# Altium project OpenRex_V1I1.PrjPcb (part 12 of 13)

## Sheet [21] - AUDIO.SchDoc
size A3; DocumentNumber: 21; SheetNumber: 21; SheetTotal: 31
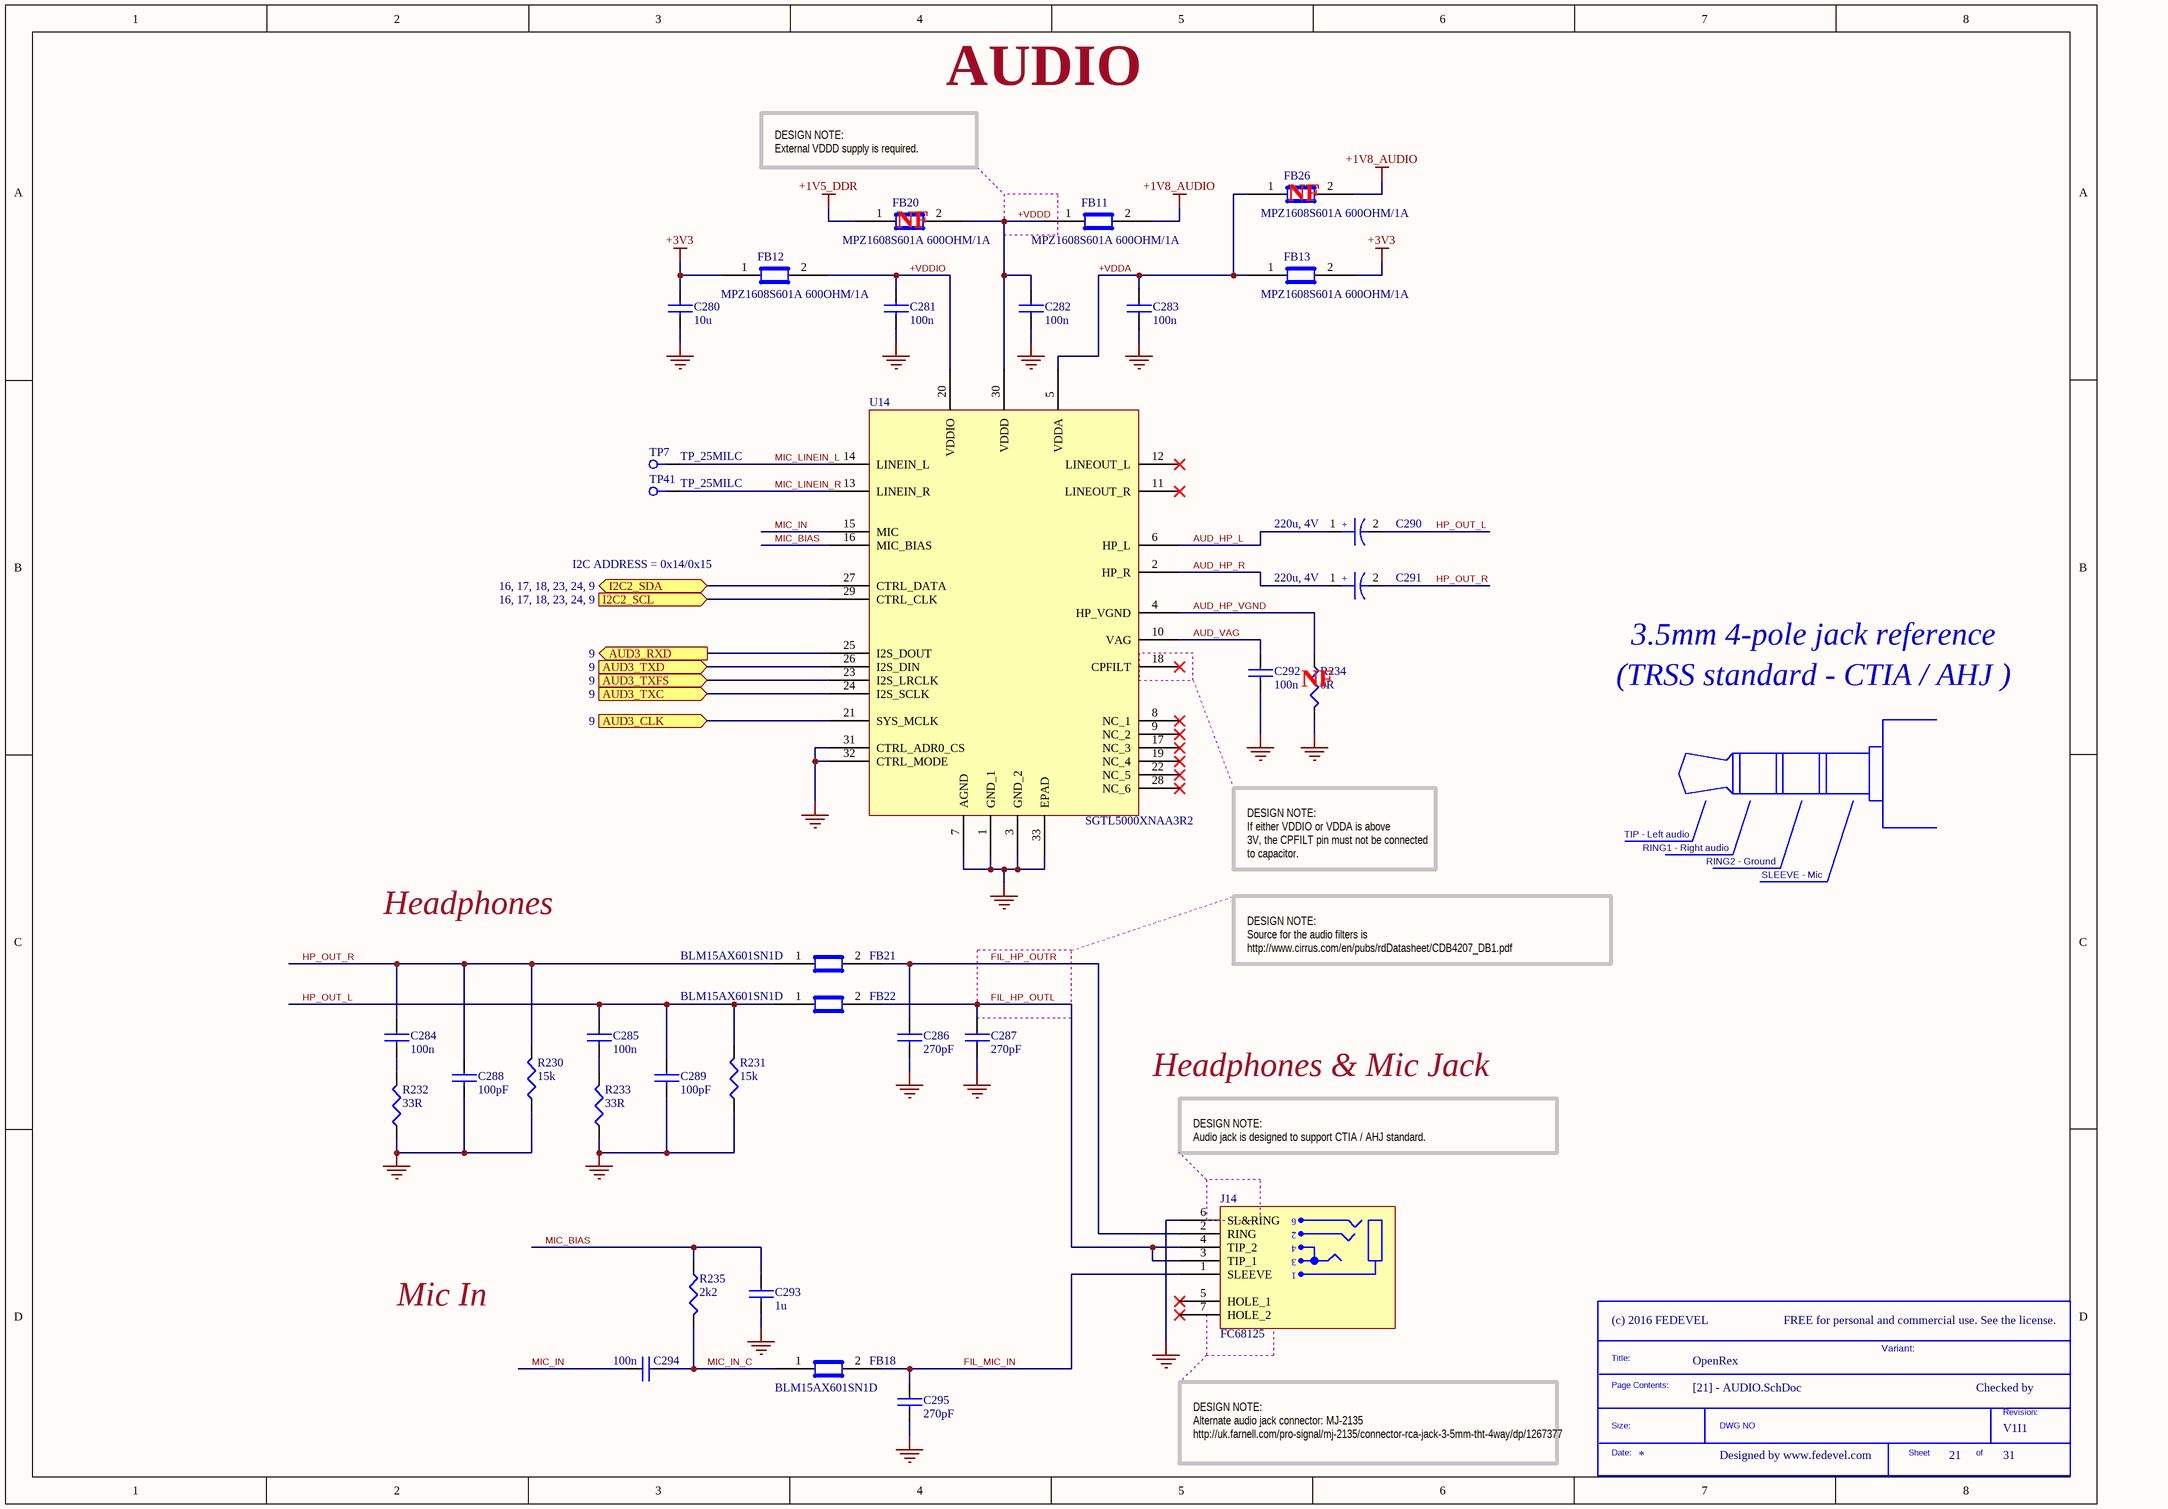
[diagram p46: [21] - AUDIO.SchDoc]

### Parts
(Parts that share a designator on the sheet are numbered #1, #2 ... from top to bottom, then left to right.)
*#28  SDTitleBlock  (value not drawn)  (graphical)
C280  10u  [C0603]
C281  100n  [C0402]
C282  100n  [C0402]
C283  100n  [C0402]
C284  100n  [C0402]
C285  100n  [C0402]
C286  270pF  [C0402]
C287  270pF  [C0402]
C288  100pF  [C0402]
C289  100pF  [C0402]
C290  220u, 4V  [C1206 -  TLN S Case Tantal]
C291  220u, 4V  [C1206 -  TLN S Case Tantal]
C292  100n  [C0402]
C293  1u  [C0402]
C294  100n  [C0402]
C295  270pF  [C0402]
FB11  MPZ1608S601A 600OHM/1A  [C0603]
FB12  MPZ1608S601A 600OHM/1A  [C0603]
FB13  MPZ1608S601A 600OHM/1A  [C0603]
FB18  BLM15AX601SN1D  [C0402]
FB20  MPZ1608S601A 600OHM/1A  [C0603]
FB21  BLM15AX601SN1D  [C0402]
FB22  BLM15AX601SN1D  [C0402]
FB26  MPZ1608S601A 600OHM/1A  [C0603]
J14  FC68125  [FC68125]
R230  15k  [R0402]
R231  15k  [R0402]
R232  33R  [R0402]
R233  33R  [R0402]
R234  0R  [R0402]
R235  2k2  [R0402]
TP7  TP_25MILC  [TP_25C]  (no BOM)
TP41  TP_25MILC  [TP_25C]  (no BOM)
U14  SGTL5000XNAA3R2  [QFN32 5x5x0.85_V1.1]

### Ports
AUD3_CLK (in, see 9), AUD3_RXD (out, see 9), AUD3_TXC (in, see 9), AUD3_TXD (in, see 9), AUD3_TXFS (in, see 9), I2C2_SCL (see 16, 17, 18, 23, 24, 9), I2C2_SDA (bidir, see 16, 17, 18, 23, 24, 9)

### Nets
+1V5_DDR: FB20.1
+1V8_AUDIO: FB11.2 FB26.2
+3V3: C280.1 FB12.1 FB13.2
GND: C280.2 C281.2 C282.2 C283.2 C286.2 C287.2 C288.2 C289.2 C292.2 C293.2 C295.2 J14.6(SL&RING) R230.1 R231.1 R232.1 R233.1 R234.2 U14.1(GND_1) U14.3(GND_2) U14.7(AGND) U14.31(CTRL_ADR0_CS) U14.32(CTRL_MODE) U14.33(EPAD)
+VDDA: C283.1 FB13.1 FB26.1 U14.5(VDDA)
+VDDD: C282.1 FB11.1 FB20.2 U14.30(VDDD)
+VDDIO: C281.1 FB12.2 U14.20(VDDIO)
AUD3_CLK: U14.21(SYS_MCLK) ; port AUD3_CLK
AUD3_RXD: U14.25(I2S_DOUT) ; port AUD3_RXD
AUD3_TXC: U14.24(I2S_SCLK) ; port AUD3_TXC
AUD3_TXD: U14.26(I2S_DIN) ; port AUD3_TXD
AUD3_TXFS: U14.23(I2S_LRCLK) ; port AUD3_TXFS
AUD_HP_L: C290.1 U14.6(HP_L)
AUD_HP_R: C291.1 U14.2(HP_R)
AUD_HP_VGND: R234.1 U14.4(HP_VGND)
AUD_VAG: C292.1 U14.10(VAG)
FIL_HP_OUTL: C287.1 FB22.2 J14.3(TIP_1) J14.4(TIP_2)
FIL_HP_OUTR: C286.1 FB21.2 J14.2(RING)
FIL_MIC_IN: C295.1 FB18.2 J14.1(SLEEVE)
HP_OUT_L: C285.1 C289.1 C290.2 FB22.1 R231.2
HP_OUT_R: C284.1 C288.1 C291.2 FB21.1 R230.2
I2C2_SCL: U14.29(CTRL_CLK) ; port I2C2_SCL
I2C2_SDA: U14.27(CTRL_DATA) ; port I2C2_SDA
MIC_BIAS: C293.1 R235.1 U14.16(MIC_BIAS)
MIC_IN: C294.1 U14.15(MIC)
MIC_IN_C: C294.2 FB18.1 R235.2
MIC_LINEIN_L: TP7.1 U14.14(LINEIN_L)
MIC_LINEIN_R: TP41.1 U14.13(LINEIN_R)
NetC284_2: C284.2 R232.2
NetC285_2: C285.2 R233.2

Not connected (* = marked no-connect by the designer): J14 5(HOLE_1)* 7(HOLE_2)*; U14 8(NC_1)* 9(NC_2)* 11(LINEOUT_R)* 12(LINEOUT_L)* 17(NC_3)* 18(CPFILT)* 19(NC_4)* 22(NC_5)* 28(NC_6)*

### Notes on the sheet
- AUDIO
- DESIGN NOTE:
  External VDDD supply is required.
- I2C ADDRESS = 0x14/0x15
- 3.5mm 4-pole jack reference
- (TRSS standard - CTIA / AHJ )
- TIP - Left audio
- RING1 - Right audio
- RING2 - Ground
- Headphones
- DESIGN NOTE:
  If either VDDIO or VDDA is above
  3V, the CPFILT pin must not be connected to capacitor.
- SLEEVE - Mic
- DESIGN NOTE:
  Source for the audio filters is http://www.cirrus.com/en/pubs/rdDatasheet/CDB4207_DB1.pdf
- Headphones & Mic Jack
- DESIGN NOTE:
  Audio jack is designed to support CTIA / AHJ standard.
- Mic In
- FREE for personal and commercial use. See the license.
- Variant:
- Checked by
- DESIGN NOTE:
  Alternate audio jack connector: MJ-2135
  http://uk.farnell.com/pro-signal/mj-2135/connector-rca-jack-3-5mm-tht-4way/dp/1267377
- Designed by www.fedevel.com
- (in symbol SDTitleBlock) Title:; Page Contents:; Revision:; Size:; DWG NO; Date:; Sheet; of
- (in symbol TLNS227M004R3000) +

### Library data of the parts
C280 = C1608X5R0J106M: CAP CER 10UF 6.3V X5R 20% 0603; Manufacturer: TDK Corporation; Capacitance: 10µF; Value: 10µF; .Checked PCB: used; Category: Capacitors; Supplier Part Number: 445-4112-1-ND; Manufacturer Part Number: C1608X5R0J106M; Operating Temperature: -55°C ~ 85°C; Package / Case: 0603 (1608 Metric); Price 1k [$]: 0.08580; .Checked SCH: used; Voltage - Rated: 6.3V; Features: Low ESR; Supplier: Digikey; Supplier 1: Digi-Key; Supplier Part Number 1: 445-4112-1-ND; RoHS: RoHS Compliant; Stock 1: 48157; Pricing 1: 1=0.46, 10=0.363, 100=0.1898, 250=0.14024, 500=0.1089, 1000=0.0858 (USD); Tolerance: ±20%; Temperature Coefficient: X5R; Mounting Type: Surface Mount, MLCC; Applications: General Purpose; Ratings: -; Size / Dimension: 0.063" L x 0.031" W (1.60mm x 0.80mm); Height - Seated (Max): -; Thickness (Max): 0.037" (0.95mm); Lead Spacing: -; Packaging: Cut Tape (CT); Lead Style: -; ComponentLink1URL: http://www.tdk.com/pdf/general_B11.pdf; ComponentLink1Description: http://www.tdk.com/pdf/general_B11.pdf
C281-C285 C292 C294 = C1005X5R1H104K: as C309 on sheet [23] - SENSORS, CAN, IR; Category: Capacitors; Supplier Part Number: 445-5942-1-ND; Manufacturer Part Number: C1005X5R1H104K; Operating Temperature: -55°C ~ 85°C; Package / Case: 0402 (1005 Metric); Price 1k [$]: 0.02340; .Checked SCH: used; Voltage - Rated: 50V; Supplier: Digikey; Supplier 1: Digi-Key; Supplier Part Number 1: 445-5942-1-ND; RoHS: RoHS Compliant; Stock 1: 106926; Pricing 1: 1=0.27, 10=0.18, 100=0.072, 250=0.05176, 500=0.0369, 1000=0.027 (USD); Tolerance: ±10%; Temperature Coefficient: X5R; Mounting Type: Surface Mount, MLCC; Applications: General Purpose; Ratings: -; Size / Dimension: 0.039" L x 0.020" W (1.00mm x 0.50mm); Height - Seated (Max): -; Thickness (Max): 0.022" (0.55mm); Lead Spacing: -; Features: -; Packaging: Cut Tape (CT); Lead Style: -; ComponentLink1URL: http://www.tdk.co.jp/tefe02/e412_c.pdf; ComponentLink1Description: http://www.tdk.co.jp/tefe02/e412_c.pdf
C286 C287 C295 = GRM155R71H271KA01D: CAP CER 270PF 50V 10% X7R 0402; Manufacturer: Murata Electronics North America; .Checked PCB: used; Supplier 1: Digi-Key; Supplier Part Number 1: 490-1299-1-ND; Manufacturer Part Number: GRM155R71H271KA01D; RoHS: RoHS Compliant; Category: Capacitors; Stock 1: 83894; Pricing 1: 10=0.032, 50=0.0252, 100=0.0189, 250=0.01364, 500=0.01008, 1000=0.00683, 5000=0.00525 (USD); Capacitance: 270pF; Voltage - Rated: 50V; Tolerance: ±10%; Temperature Coefficient: X7R; Mounting Type: Surface Mount, MLCC; Operating Temperature: -55°C ~ 125°C; Applications: General Purpose; Ratings: -; Package / Case: 0402 (1005 Metric); Size / Dimension: 0.039" L x 0.020" W (1.00mm x 0.50mm); Height - Seated (Max): -; Thickness (Max): 0.022" (0.55mm); Lead Spacing: -; Features: -; Packaging: Cut Tape (CT); Lead Style: -; ComponentLink1URL: http://search.murata.co.jp/Ceramy/image/img/PDF/ENG/GRM155R71H271KA01.pdf; ComponentLink1Description: http://search.murata.co.jp/Ceramy/image/img/PDF/ENG/GRM155R71H271KA01.pdf; .Checked SCH: used
C288 C289 = C1005C0G1H101J: as C311 on sheet [23] - SENSORS, CAN, IR; Supplier 1: Digi-Key; Supplier Part Number 1: 445-1247-1-ND; Manufacturer Part Number: C1005C0G1H101J; RoHS: RoHS Compliant; Category: Capacitors; Stock 1: 298233; Pricing 1: 1=0.08, 10=0.05, 100=0.018, 250=0.013, 500=0.0096, 1000=0.0065 (USD); Capacitance: 100pF; Voltage - Rated: 50V; Tolerance: ±5%; Mounting Type: Surface Mount, MLCC; Operating Temperature: -55°C ~ 125°C; Applications: General Purpose; Ratings: -; Package / Case: 0402 (1005 Metric); Size / Dimension: 0.039" L x 0.020" W (1.00mm x 0.50mm); Height - Seated (Max): -; Thickness (Max): 0.022" (0.55mm); Lead Spacing: -; Features: -; Packaging: Cut Tape (CT); Lead Style: -; ComponentLink1URL: http://www.tdk.com/pdf/general_B11.pdf; ComponentLink1Description: http://www.tdk.com/pdf/general_B11.pdf; .Checked SCH: used
C290 C291 = TLNS227M004R3000: CAP TANT 220UF 4V 20% 1206; Manufacturer: AVX Corporation; Manufacturer Size Code: S; Capacitance: 220µF; ESR (Equivalent Series Resistance): 3.000 Ohm; Type: Molded; .Checked PCB: used; Supplier 1: Digi-Key; Supplier Part Number 1: 478-5526-1-ND; Manufacturer Part Number: TLNS227M004R3000; RoHS: RoHS Compliant; Category: Capacitors; Stock 1: 21393; Pricing 1: 1=1.35, 10=1.128, 100=0.72, 250=0.6, 500=0.54, 1000=0.492 (USD); Voltage - Rated: 4V; Tolerance: ±20%; Operating Temperature: -55°C ~ 125°C; Mounting Type: Surface Mount; Package / Case: 1206 (3216 Metric); Size / Dimension: 0.126" L x 0.063" W (3.20mm x 1.60mm); Height - Seated (Max): 0.047" (1.20mm); Lead Spacing: -; Features: General Purpose; Packaging: Cut Tape (CT); Lifetime @ Temp.: -; ComponentLink1URL: http://www.avx.com/docs/Catalogs/tlnunder.pdf; ComponentLink1Description: http://www.avx.com/docs/Catalogs/tlnunder.pdf; .Checked SCH: used
C293 = C1005X5R1C105K: as C326 on sheet [23] - SENSORS, CAN, IR; Category: Capacitors; Supplier Part Number: 445-4978-1-ND; Manufacturer Part Number: C1005X5R1C105K; Operating Temperature: -55°C ~ 85°C; Package / Case: 0402 (1005 Metric); Price 1k [$]: 0.02080; .Checked SCH: used; Voltage - Rated: 16V; Supplier: Digikey; Supplier 1: Digi-Key; Supplier Part Number 1: 445-4978-1-ND; RoHS: RoHS Compliant; Stock 1: 341010; Pricing 1: 1=0.24, 10=0.16, 100=0.064, 250=0.046, 500=0.0328, 1000=0.024 (USD); Temperature Coefficient: X5R; Mounting Type: Surface Mount, MLCC; Applications: General Purpose; Ratings: -; Size / Dimension: 0.039" L x 0.020" W (1.00mm x 0.50mm); Height - Seated (Max): -; Thickness (Max): 0.022" (0.55mm); Lead Spacing: -; Features: -; Packaging: Cut Tape (CT); Lead Style: -; ComponentLink1URL: http://www.tdk.co.jp/tefe02/e412_c.pdf; ComponentLink1Description: http://www.tdk.co.jp/tefe02/e412_c.pdf
FB11-FB13 FB20 FB26 = MPZ1608S601A: as FB33 on sheet [23] - SENSORS, CAN, IR; Supplier 1: Digi-Key; Supplier Part Number 1: 445-2205-1-ND; Manufacturer Part Number: MPZ1608S601A; RoHS: RoHS Compliant; Category: Filters; Stock 1: 328345; Pricing 1: 1=0.36, 10=0.24, 100=0.096, 250=0.069, 500=0.0492, 1000=0.036 (USD); Current Rating: 1A; Package / Case: 0603 (1608 Metric); Mounting Type: Surface Mount; Packaging: Cut Tape (CT); Height (Max): 0.037" (0.95mm); Size / Dimension: 0.063" L x 0.031" W (1.60mm x 0.80mm); ComponentLink1URL: http://www.tdk.co.jp/tefe02/e9413_mpz.pdf; ComponentLink1Description: http://www.tdk.co.jp/tefe02/e9413_mpz.pdf; .Checked SCH: used
FB18 FB21 FB22 = BLM15AX601SN1D: as FB43 on sheet [23] - SENSORS, CAN, IR; .Checked SCH: used; Category: Filters; Manufacturer Part Number: BLM15AX601SN1D; Package / Case: 0402 (1005 Metric); Current Rating: 420mA; Supplier 1: Digi-Key; Supplier Part Number 1: 490-5441-1-ND; RoHS: RoHS Compliant; Stock 1: 34008; Pricing 1: 1=0.26, 10=0.197, 50=0.1148, 100=0.0918, 250=0.0656, 500=0.0446, 1000=0.03608, 5000=0.02821 (USD); Mounting Type: Surface Mount; Packaging: Cut Tape (CT); Height (Max): 0.022" (0.55mm); Size / Dimension: 0.039" L x 0.020" W (1.00mm x 0.50mm); ComponentLink1URL: http://search.murata.co.jp/Ceramy/image/img/PDF/ENG/L0110S0100BLM15AX_SN.pdf; ComponentLink1Description: http://search.murata.co.jp/Ceramy/image/img/PDF/ENG/L0110S0100BLM15AX_SN.pdf; Supplier Part Number: 490-5441-1-ND; Price 1k [$]: 0.03280; Value: BLM15AX601SN1D; Supplier: Digikey
J14 = FC68125: CLIFF ELECTRONIC COMPONENTS - FC68125 - CONNECTOR, PHONO, 3.5MM, JACK, 4POLE; .Creator: MM; Supplier 1: Farnell; Manufacturer: CLIFF ELECTRONIC COMPONENTS; Manufacturer Part Number: FC68125; RoHS: YES; Stock 1: 5095; Pricing 1: 1=1.18, 10=0.652, 25=0.505, 50=0.433, 100=0.371, 500=0.316 (GBP); ComponentLink1URL: http://www.farnell.com/cad/1803251.pdf; ComponentLink1Description: http://www.farnell.com/cad/1803251.pdf; ComponentLink2URL: http://www.farnell.com/datasheets/1759063.pdf; ComponentLink2Description: http://www.farnell.com/datasheets/1759063.pdf; Supplier Part Number 1: 2309468; Category: Connectors, Interconnects; .Checked PCB: MM; .Checked SCH: MM
R230 R231 = RC0402FR-0715KL: as R47 on sheet [16] - HDMI; Category: Resistors; Supplier Part Number: 311-15.0KLRCT-ND; Manufacturer Part Number: RC0402FR-0715KL; Package / Case: 0402 (1005 Metric); Price 1k [$]: 0.01421; Resistance (Ohms): 15K; Tolerance: ±1%; Value: 15k; .Checked SCH: used; Supplier: Digikey; Supplier 1: Digi-Key; Supplier Part Number 1: 311-15.0KLRCT-ND; RoHS: RoHS Compliant; Stock 1: 31992; Pricing 1: 10=0.014, 50=0.0104, 100=0.0079, 250=0.00584, 500=0.00432, 1000=0.00288 (USD); Composition: Thick Film; Features: -; Size / Dimension: 0.039" L x 0.020" W (1.00mm x 0.50mm); Height: 0.016" (0.40mm); Number of Terminations: 2; Packaging: Cut Tape (CT); ComponentLink1URL: http://www.yageo.com/documents/recent/PYu-RC0402_51_RoHS_L_6.pdf; ComponentLink1Description: http://www.yageo.com/documents/recent/PYu-RC0402_51_RoHS_L_6.pdf
R232 R233 = RMCF0402FT33R0: RES TF 33 OHM 1% 1/16W 0402; Manufacturer: Stackpole Electronics Inc; Resistance (Ohms): 33; Power (Watts): 0.063W, 1/16W; .Checked PCB: used; Temperature Coefficient: ±100ppm/°C; Category: Resistors; Supplier Part Number: RMCF0402FT33R0CT-ND; Manufacturer Part Number: RMCF0402FT33R0; Package / Case: 0402 (1005 Metric); Price 1k [$]: 0.00384; Tolerance: ±1%; Value: 33R; .Checked SCH: used; Supplier: Digikey; Supplier 1: Digi-Key; Supplier Part Number 1: RMCF0402FT33R0CT-ND; RoHS: RoHS Compliant; Stock 1: 26866; Pricing 1: 1=0.04, 10=0.025, 50=0.0138, 100=0.0105, 250=0.0078, 500=0.00576, 1000=0.00384 (USD); Composition: Thick Film; Features: -; Size / Dimension: 0.039" L x 0.020" W (1.00mm x 0.50mm); Height: 0.016" (0.40mm); Number of Terminations: 2; Packaging: Cut Tape (CT); ComponentLink1URL: http://www.seielect.com/Catalog/SEI-RMCF.pdf; ComponentLink1Description: http://www.seielect.com/Catalog/SEI-RMCF.pdf
R234 = RC0402JR-070RL: as R41 on sheet [23] - SENSORS, CAN, IR; Category: Resistors; Supplier Part Number: 311-0.0JRCT-ND; Manufacturer Part Number: RC0402JR-070RL; Package / Case: 0402 (1005 Metric); Price 1k [$]: 0.01389; Value: 0R; .Checked SCH: used; Supplier: Digikey; Supplier 1: Digi-Key; Supplier Part Number 1: 311-0.0JRCT-ND; RoHS: RoHS Compliant; Stock 1: 1106330; Pricing 1: 10=0.012, 50=0.009, 100=0.0069, 250=0.00512, 500=0.0038, 1000=0.00253 (USD); Composition: Thick Film; Features: -; Temperature Coefficient: -; Size / Dimension: 0.039" L x 0.020" W (1.00mm x 0.50mm); Height: 0.016" (0.40mm); Number of Terminations: 2; Packaging: Cut Tape (CT); ComponentLink1URL: http://www.yageo.com/documents/recent/PYu-RC0402_51_RoHS_L_6.pdf; ComponentLink1Description: http://www.yageo.com/documents/recent/PYu-RC0402_51_RoHS_L_6.pdf
R235 = RC0402FR-072K2L: RES 2.20K OHM 1/16W 1% 0402 SMD; Manufacturer: Yageo; Resistance (Ohms): 2.2K; Power (Watts): 0.063W, 1/16W; .Checked PCB: used; Temperature Coefficient: ±100ppm/°C; Category: Resistors; Supplier Part Number: 311-2.20KLRCT-ND; Manufacturer Part Number: RC0402FR-072K2L; Package / Case: 0402 (1005 Metric); Price 1k [$]: 0.01421; Tolerance: ±1%; Value: 2k2; .Checked SCH: used; Supplier: Digikey; Supplier 1: Digi-Key; Supplier Part Number 1: 311-2.20KLRCT-ND; RoHS: RoHS Compliant; Stock 1: 195154; Pricing 1: 10=0.014, 50=0.0104, 100=0.0079, 250=0.00584, 500=0.00432, 1000=0.00288 (USD); Composition: Thick Film; Features: -; Size / Dimension: 0.039" L x 0.020" W (1.00mm x 0.50mm); Height: 0.016" (0.40mm); Number of Terminations: 2; Packaging: Cut Tape (CT); ComponentLink1URL: http://www.yageo.com/documents/recent/PYu-RC0402_51_RoHS_L_6.pdf; ComponentLink1Description: http://www.yageo.com/documents/recent/PYu-RC0402_51_RoHS_L_6.pdf
TP7 TP41 = TP_25MILC: Test Point 25mil
U14 = SGTL5000XNAA3R2: IC AUDIO CODEC STEREO 32-QFN; Manufacturer: Freescale Semiconductor; Data Interface: I²C, Serial, SPI™; Number of ADCs / DACs: 1 / 1; Sigma Delta: No; S/N Ratio, ADCs / DACs (db) Typ: 90 / 100; Voltage - Supply, Analog: 1.62 V ~ 3.6 V; Voltage - Supply, Digital: 1.1 V ~ 2 V, 1.62 V ~ 3.6 V; .Creator: MM; .Checked PCB: used; Supplier 1: Digi-Key; Manufacturer Part Number: SGTL5000XNAA3R2; RoHS: RoHS Compliant; Category: Integrated Circuits (ICs); Stock 1: 0; Pricing 1: 1=2.66, 10=2.375, 25=2.2324, 100=2.1375, 250=2.04252, 500=1.9, 1000=1.8525 (USD); Packaging: Cut Tape (CT); Type: Stereo Audio; Resolution (Bits): -; Dynamic Range, ADCs / DACs (db) Typ: -; Operating Temperature: -40°C ~ 85°C; Mounting Type: Surface Mount; Package / Case: 32-VFQFN Exposed Pad; Supplier Device Package: 32-QFN Exposed Pad (5x5); ComponentLink1URL: http://cache.freescale.com/files/analog/doc/data_sheet/SGTL5000.pdf; ComponentLink1Description: http://cache.freescale.com/files/analog/doc/data_sheet/SGTL5000.pdf; Supplier Part Number 1: SGTL5000XNAA3R2CT-ND; .Checked SCH: used

## Sheet [24] - HEADERS, UART.SchDoc
size A2; DocumentNumber: 24; SheetNumber: 24; SheetTotal: 31
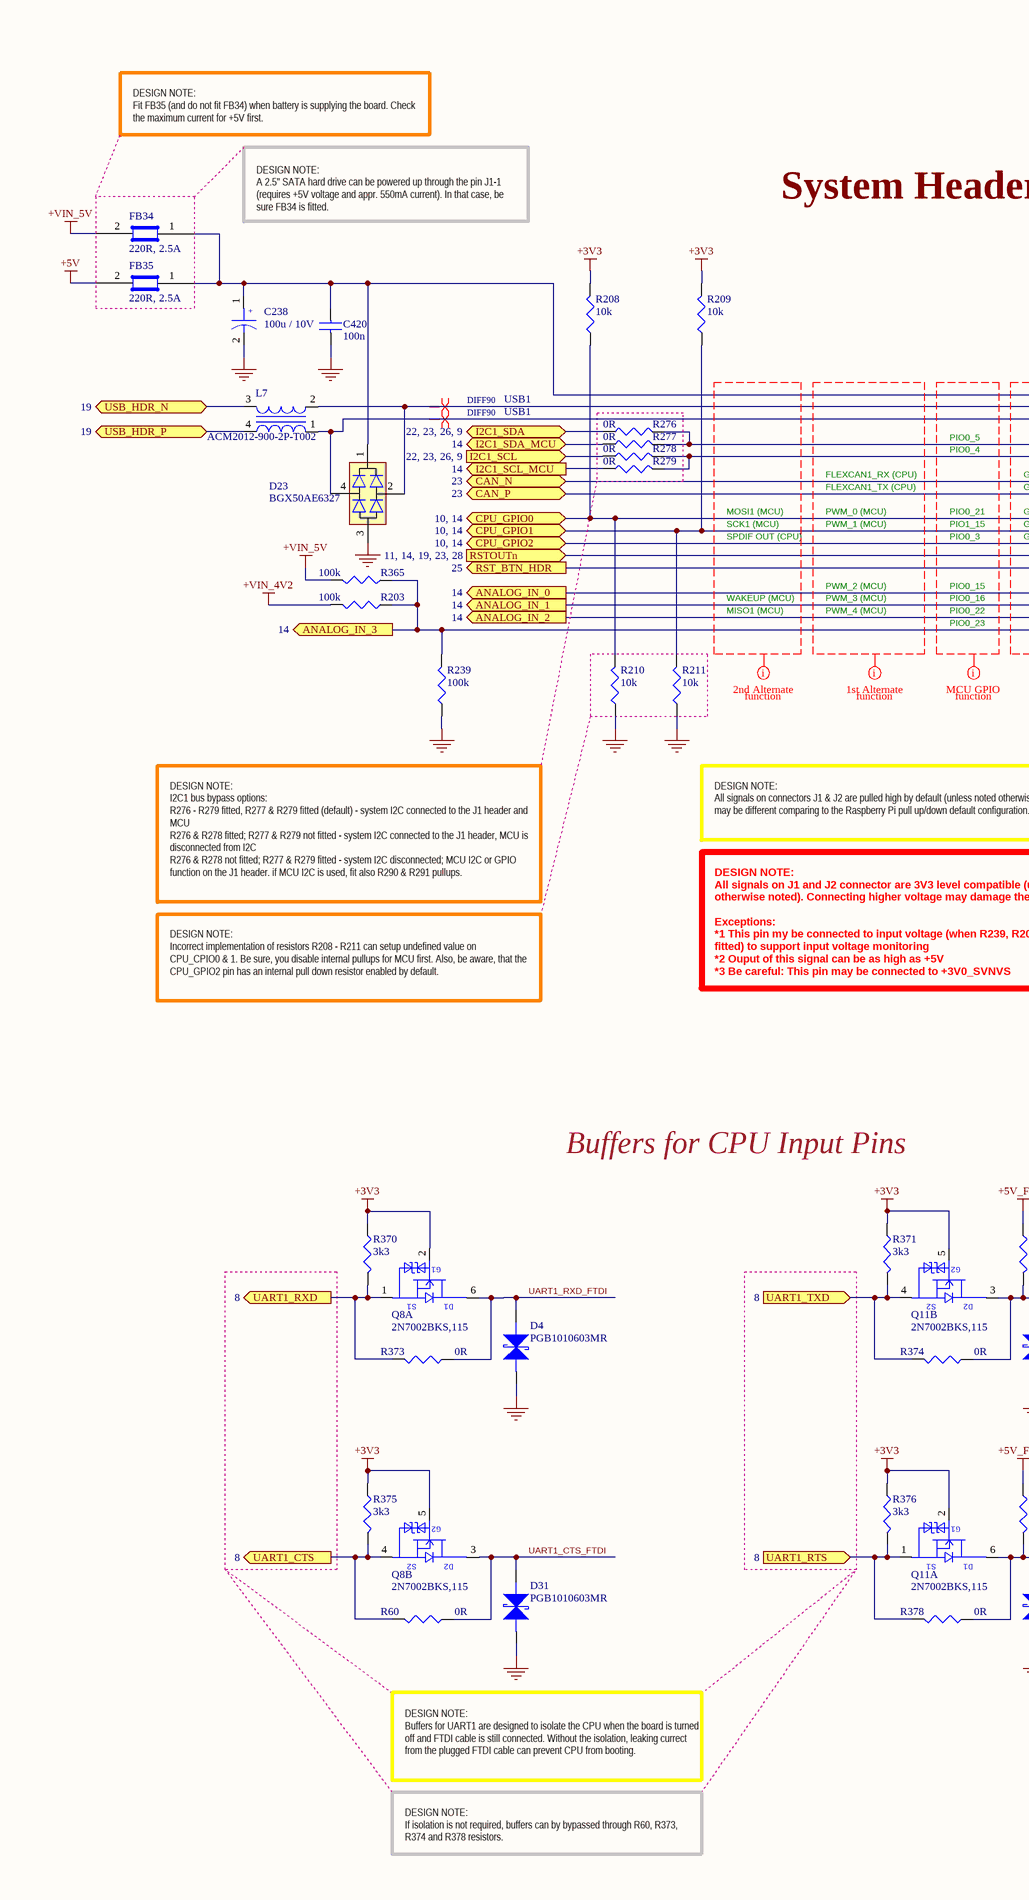
[diagram p47: [24] - HEADERS, UART.SchDoc, left]
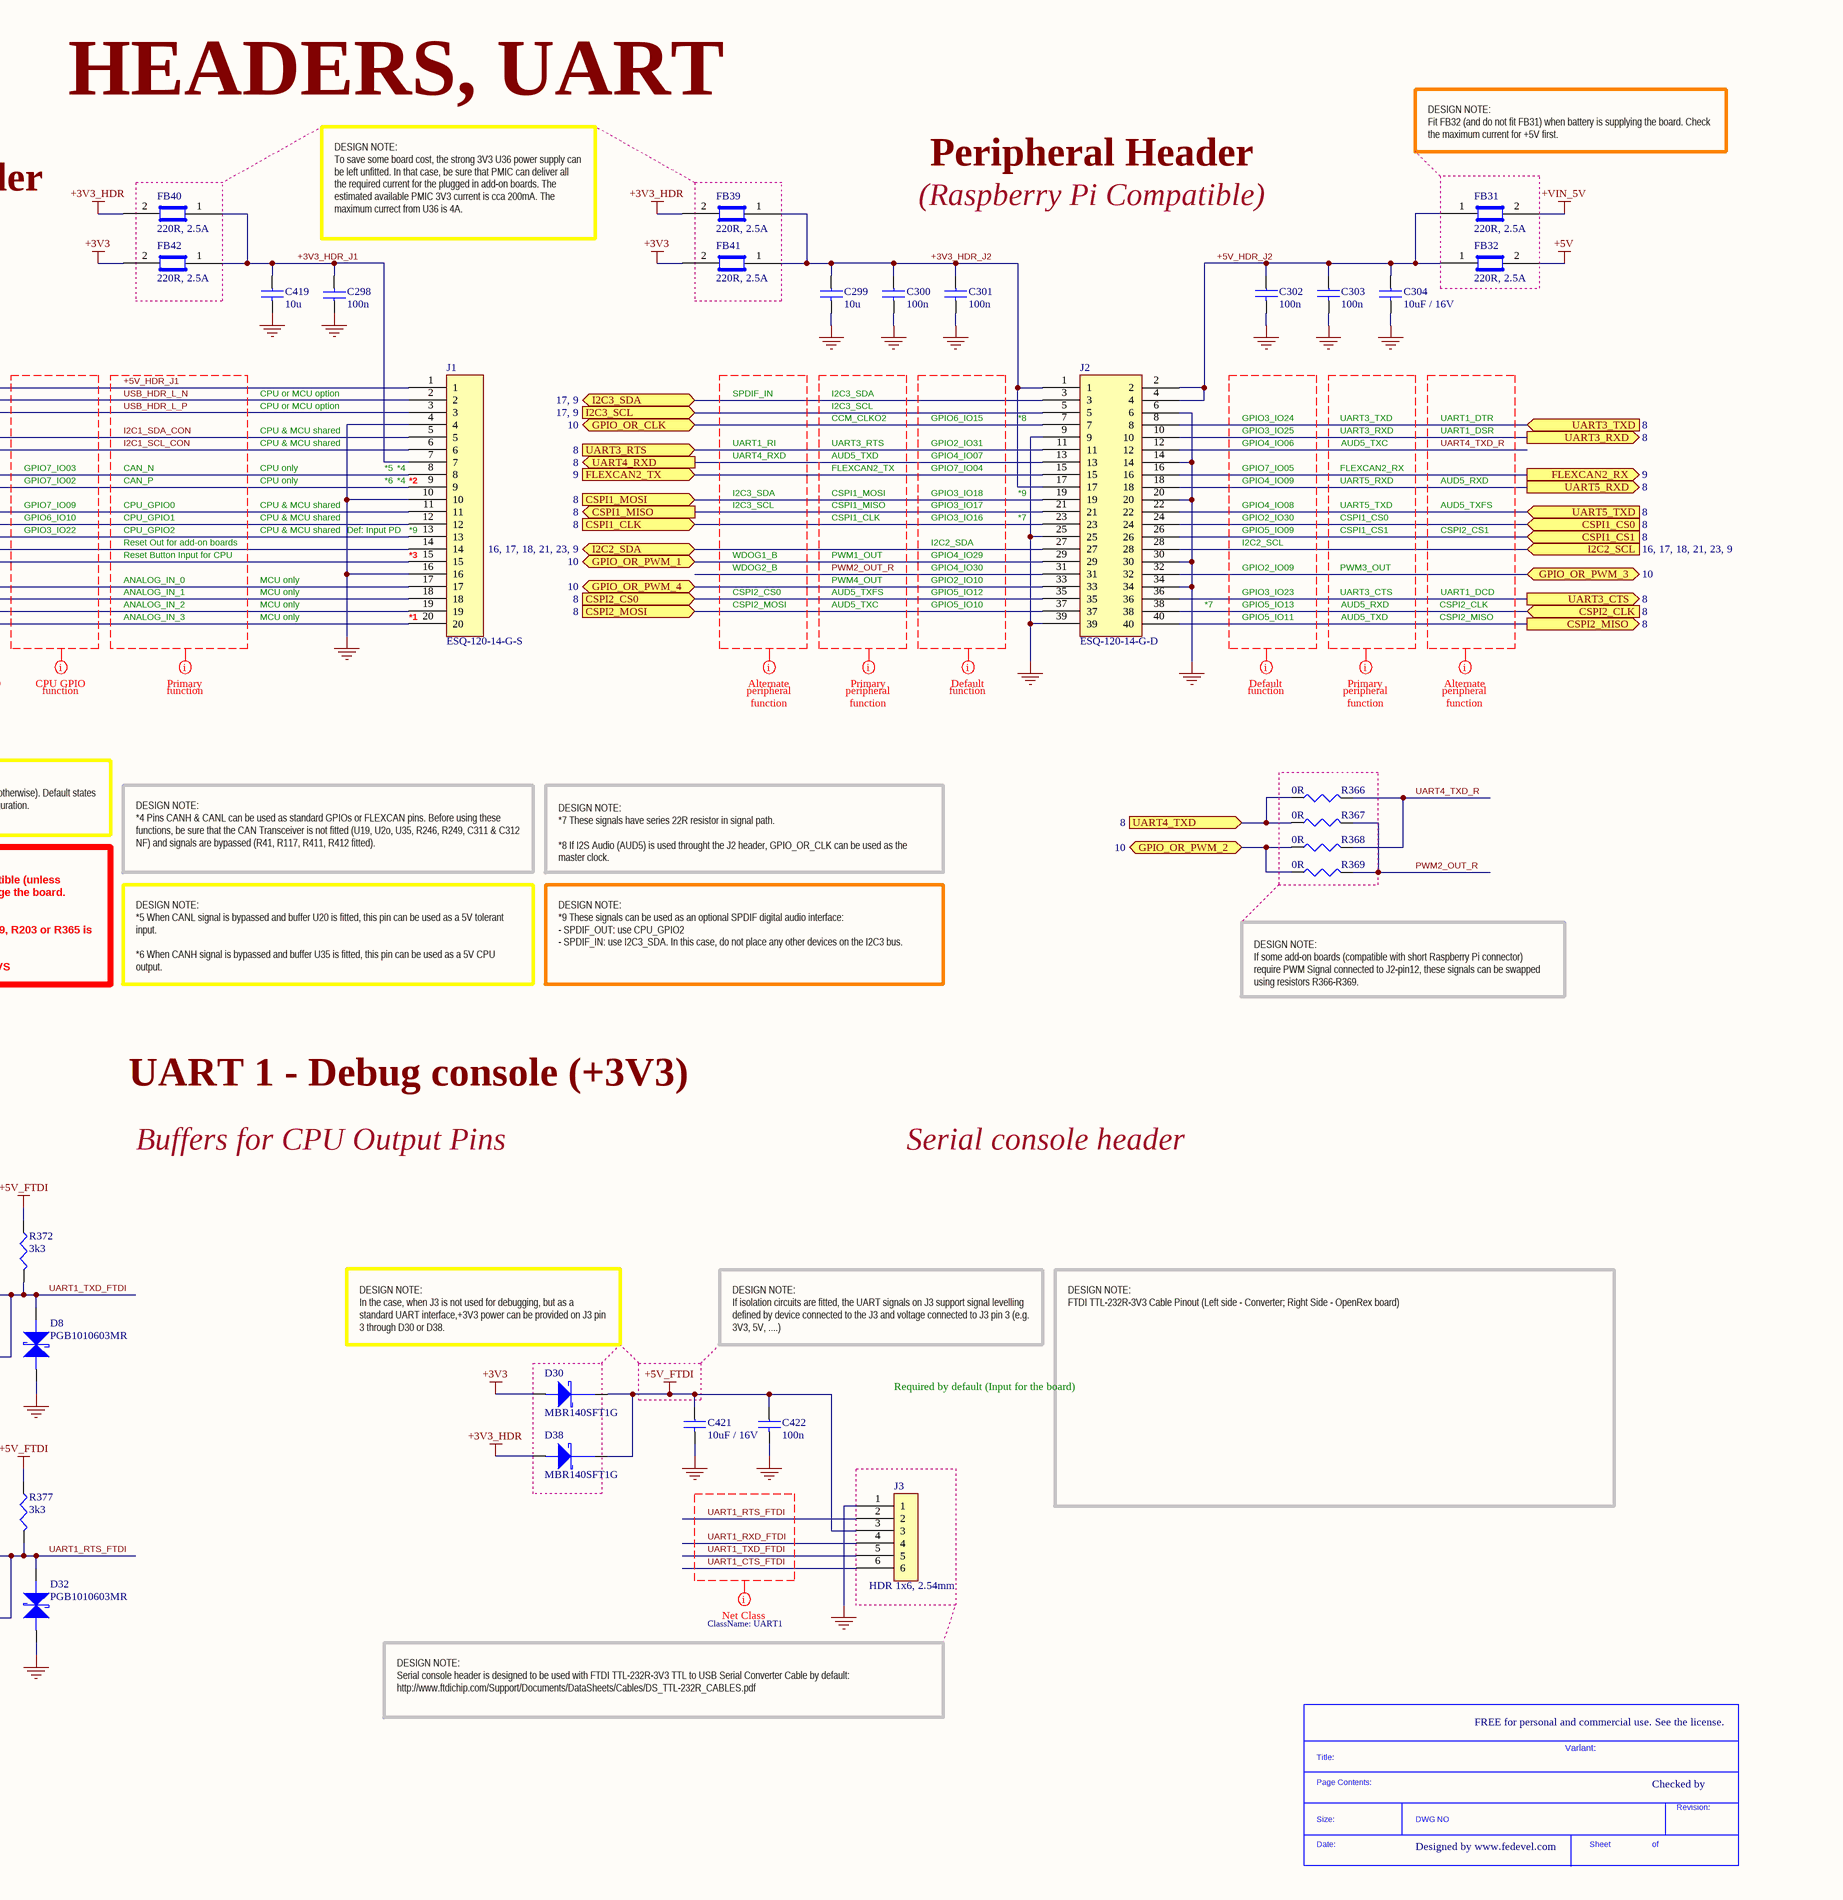
[diagram p48: [24] - HEADERS, UART.SchDoc, right]

### Parts
(Parts that share a designator on the sheet are numbered #1, #2 ... from top to bottom, then left to right.)
*#29  SDTitleBlock  (value not drawn)  (graphical)
C238  100u / 10V  [C2312]
C298  100n  [C0402]
C299  10u  [C0603]
C300  100n  [C0402]
C301  100n  [C0402]
C302  100n  [C0402]
C303  100n  [C0402]
C304  10uF / 16V  [C0805]
C419  10u  [C0603]
C420  100n  [C0402]
C421  10uF / 16V  [C0805]
C422  100n  [C0402]
D4  PGB1010603MR  [C0603]
D8  PGB1010603MR  [C0603]
D23  BGX50AE6327  [SOT143]
D30  MBR140SFT1G  [SOD-123FL]
D31  PGB1010603MR  [C0603]
D32  PGB1010603MR  [C0603]
D38  MBR140SFT1G  [SOD-123FL]
FB31  220R, 2.5A  [C0603]
FB32  220R, 2.5A  [C0603]
FB34  220R, 2.5A  [C0603]
FB35  220R, 2.5A  [C0603]
FB39  220R, 2.5A  [C0603]
FB40  220R, 2.5A  [C0603]
FB41  220R, 2.5A  [C0603]
FB42  220R, 2.5A  [C0603]
J1  ESQ-120-14-G-S  [ESQ-120-14-G-S]
J2  ESQ-120-14-G-D  [ESQ-120-14-G-D]
J3  HDR 1x6, 2.54mm  [Hdr_1x6_2.54mm]
L7  ACM2012-900-2P-T002  [ACM2012]
Q8  2N7002BKS,115  [SOT363]  (parts A,B of 2)
Q11  2N7002BKS,115  [SOT363]  (parts A,B of 2)
R60  0R  [R0402]
R203  100k  [R0402]
R208  10k  [R0402]
R209  10k  [R0402]
R210  10k  [R0402]
R211  10k  [R0402]
R239  100k  [R0402]
R276  0R  [R0402]
R277  0R  [R0402]
R278  0R  [R0402]
R279  0R  [R0402]
R365  100k  [R0402]
R366  0R  [R0402]
R367  0R  [R0402]
R368  0R  [R0402]
R369  0R  [R0402]
R370  3k3  [R0402]
R371  3k3  [R0402]
R372  3k3  [R0402]
R373  0R  [R0402]
R374  0R  [R0402]
R375  3k3  [R0402]
R376  3k3  [R0402]
R377  3k3  [R0402]
R378  0R  [R0402]

### Ports
ANALOG_IN_0 (out, see 14), ANALOG_IN_1 (out, see 14), ANALOG_IN_2 (out, see 14), ANALOG_IN_3 (out, see 14), CAN_N (bidir, see 23), CAN_P (bidir, see 23), CPU_GPIO0 (bidir, see 10, 14), CPU_GPIO1 (bidir, see 10, 14), CPU_GPIO2 (bidir, see 10, 14), CSPI1_CLK (in, see 8), CSPI1_CS0 (in, see 8), CSPI1_CS1 (in, see 8), CSPI1_MISO (out, see 8), CSPI1_MOSI (in, see 8), CSPI2_CLK (in, see 8), CSPI2_CS0 (in, see 8), CSPI2_MISO (out, see 8), CSPI2_MOSI (in, see 8), FLEXCAN2_RX (out, see 9), FLEXCAN2_TX (in, see 9), GPIO_OR_CLK (bidir, see 10), GPIO_OR_PWM_1 (bidir, see 10), GPIO_OR_PWM_2 (bidir, see 10), GPIO_OR_PWM_3 (bidir, see 10), GPIO_OR_PWM_4 (bidir, see 10), I2C1_SCL (see 22, 23, 26, 9), I2C1_SCL_MCU (out, see 14), I2C1_SDA (bidir, see 22, 23, 26, 9), I2C1_SDA_MCU (bidir, see 14), I2C2_SCL (see 16, 17, 18, 21, 23, 9), I2C2_SDA (bidir, see 16, 17, 18, 21, 23, 9), I2C3_SCL (see 17, 9), I2C3_SDA (bidir, see 17, 9), RST_BTN_HDR (out, see 25), RSTOUTn (see 11, 14, 19, 23, 28), UART1_CTS (out, see 8), UART1_RTS (in, see 8), UART1_RXD (out, see 8), UART1_TXD (in, see 8), UART3_CTS (out, see 8), UART3_RTS (in, see 8), UART3_RXD (out, see 8), UART3_TXD (in, see 8), UART4_RXD (out, see 8), UART4_TXD (in, see 8), UART5_RXD (out, see 8), UART5_TXD (in, see 8), USB_HDR_N (bidir, see 19), USB_HDR_P (bidir, see 19)

### Nets
+3V3: D30.2(Anode) FB41.2 FB42.2 Q8.2(GATE1) Q8.5(GATE2) Q11.2(GATE1) Q11.5(GATE2) R208.2 R209.2 R370.2 R371.2 R375.2 R376.2
+3V3_HDR: D38.2(Anode) FB39.2 FB40.2
+5V: FB32.2 FB35.2
+5V_FTDI: C421.1 C422.1 D30.1(Cathode) D38.1(Cathode) J3.3 R372.2 R377.2
+VIN_4V2: R203.2
+VIN_5V: FB31.2 FB34.2 R365.2
GND: C238.2 C298.1 C299.2 C300.2 C301.2 C302.2 C303.2 C304.2 C419.2 C420.2 C421.2 C422.2 D4.2 D8.2 D23.3 D31.2 D32.2 J1.4 J1.10 J1.16 J2.6 J2.9 J2.14 J2.20 J2.25 J2.30 J2.34 J2.39 J3.1 R210.1 R211.1 R239.1
+3V3_HDR_J1: C298.2 C419.1 FB40.1 FB42.1 J1.7
+3V3_HDR_J2: C299.1 C300.1 C301.1 FB39.1 FB41.1 J2.1 J2.17
+5V_HDR_J1: C238.1 C420.1 D23.1 FB34.1 FB35.1 J1.1
+5V_HDR_J2: C302.1 C303.1 C304.1 FB31.1 FB32.1 J2.2 J2.4
ANALOG_IN_0: J1.17 ; port ANALOG_IN_0
ANALOG_IN_1: J1.18 ; port ANALOG_IN_1
ANALOG_IN_2: J1.19 ; port ANALOG_IN_2
ANALOG_IN_3: J1.20 R203.1 R239.2 R365.1 ; port ANALOG_IN_3
CAN_N: J1.8 ; port CAN_N
CAN_P: J1.9 ; port CAN_P
CPU_GPIO0: J1.11 R208.1 R210.2 ; port CPU_GPIO0
CPU_GPIO1: J1.12 R209.1 R211.2 ; port CPU_GPIO1
CPU_GPIO2: J1.13 ; port CPU_GPIO2
CSPI1_CLK: J2.23 ; port CSPI1_CLK
CSPI1_CS0: J2.24 ; port CSPI1_CS0
CSPI1_CS1: J2.26 ; port CSPI1_CS1
CSPI1_MISO: J2.21 ; port CSPI1_MISO
CSPI1_MOSI: J2.19 ; port CSPI1_MOSI
CSPI2_CLK: J2.38 ; port CSPI2_CLK
CSPI2_CS0: J2.35 ; port CSPI2_CS0
CSPI2_MISO: J2.40 ; port CSPI2_MISO
CSPI2_MOSI: J2.37 ; port CSPI2_MOSI
FLEXCAN2_RX: J2.16 ; port FLEXCAN2_RX
FLEXCAN2_TX: J2.15 ; port FLEXCAN2_TX
GPIO_OR_CLK: J2.7 ; port GPIO_OR_CLK
GPIO_OR_PWM_1: J2.29 ; port GPIO_OR_PWM_1
GPIO_OR_PWM_2: R368.1 R369.1 ; port GPIO_OR_PWM_2
GPIO_OR_PWM_3: J2.32 ; port GPIO_OR_PWM_3
GPIO_OR_PWM_4: J2.33 ; port GPIO_OR_PWM_4
I2C1_SCL: R278.1 ; port I2C1_SCL
I2C1_SCL_CON: J1.6 R278.2 R279.2
I2C1_SCL_MCU: R279.1 ; port I2C1_SCL_MCU
I2C1_SDA: R276.1 ; port I2C1_SDA
I2C1_SDA_CON: J1.5 R276.2 R277.2
I2C1_SDA_MCU: R277.1 ; port I2C1_SDA_MCU
I2C2_SCL: J2.28 ; port I2C2_SCL
I2C2_SDA: J2.27 ; port I2C2_SDA
I2C3_SCL: J2.5 ; port I2C3_SCL
I2C3_SDA: J2.3 ; port I2C3_SDA
PWM2_OUT_R: J2.31 R367.2 R369.2
RST_BTN_HDR: J1.15 ; port RST_BTN_HDR
RSTOUTn: J1.14 ; port RSTOUTn
UART1_CTS: Q8.4(SOURCE2) R60.1 R375.1 ; port UART1_CTS
UART1_CTS_FTDI: D31.1 J3.6 Q8.3(DRAIN2) R60.2
UART1_RTS: Q11.1(SOURCE1) R376.1 R378.1 ; port UART1_RTS
UART1_RTS_FTDI: D32.1 J3.2 Q11.6(DRAIN1) R377.1 R378.2
UART1_RXD: Q8.1(SOURCE1) R370.1 R373.1 ; port UART1_RXD
UART1_RXD_FTDI: D4.1 J3.4 Q8.6(DRAIN1) R373.2
UART1_TXD: Q11.4(SOURCE2) R371.1 R374.1 ; port UART1_TXD
UART1_TXD_FTDI: D8.1 J3.5 Q11.3(DRAIN2) R372.1 R374.2
UART3_CTS: J2.36 ; port UART3_CTS
UART3_RTS: J2.11 ; port UART3_RTS
UART3_RXD: J2.10 ; port UART3_RXD
UART3_TXD: J2.8 ; port UART3_TXD
UART4_RXD: J2.13 ; port UART4_RXD
UART4_TXD: R366.1 R367.1 ; port UART4_TXD
UART4_TXD_R: J2.12 R366.2 R368.2
UART5_RXD: J2.18 ; port UART5_RXD
UART5_TXD: J2.22 ; port UART5_TXD
USB_HDR_L_N: D23.2 J1.2 L7.2
USB_HDR_L_P: D23.4 J1.3 L7.1
USB_HDR_N: L7.3 ; port USB_HDR_N
USB_HDR_P: L7.4 ; port USB_HDR_P

### Layout directives
differential pair; net class DIFF90; net class USB1: USB_HDR_L_N, USB_HDR_L_P
mark named Primary: (no net found under the mark), +5V_HDR_J1, I2C1_SCL_CON, I2C1_SDA_CON, PWM2_OUT_R, USB_HDR_L_N, USB_HDR_L_P
mark named Default: (no net found under the mark)
mark named Alternate: (no net found under the mark), UART4_TXD_R
mark named CPU GPIO: (no net found under the mark)
mark named 1st Alternate: (no net found under the mark)
mark named MCU GPIO: (no net found under the mark)
mark named 2nd Alternate: (no net found under the mark)
net class UART1: UART1_CTS_FTDI, UART1_RTS_FTDI, UART1_RXD_FTDI, UART1_TXD_FTDI

### Notes on the sheet
- DESIGN NOTE:
  Fit FB35 (and do not fit FB34) when battery is supplying the board. Check the maximum current for +5V first.
- HEADERS, UART
- Peripheral Header
- DESIGN NOTE:
  Fit FB32 (and do not fit FB31) when battery is supplying the board. Check the maximum current for +5V first.
- DESIGN NOTE:
  A 2.5" SATA hard drive can be powered up through the pin J1-1 (requires +5V voltage and appr. 550mA current). In that case, be sure FB34 is fitted.
- System Header
- DESIGN NOTE:
  To save some board cost, the strong 3V3 U36 power supply can be left unfitted. In that case, be sure that PMIC can deliver all the required current for the plugged in add-on boards. The estimated available PMIC 3V3 current is cca 200mA. The maximum currect from U36 is 4A.
- (Raspberry Pi Compatible)
- PIO0_5
- CPU & MCU shared
- CPU or MCU option
- SPDIF_IN
- I2C3_SCL
- I2C3_SDA
- CCM_CLKO2
- GPIO6_IO15
- *8
- GPIO3_IO24
- GPIO3_IO25
- UART3_TXD
- UART3_RXD
- UART1_DTR
- UART1_DSR
- FLEXCAN1_TX (CPU)
- FLEXCAN1_RX (CPU)
- PIO0_4
- GPIO7_IO02
- GPIO7_IO03
- CAN_P
- CAN_N
- CPU only
- *5
- *6
- (near J1) *4
- (near J1) *2
- UART1_RI
- UART4_RXD
- UART3_RTS
- FLEXCAN2_TX
- CSPI1_MOSI
- AUD5_TXD
- GPIO2_IO31
- GPIO7_IO04
- GPIO3_IO18
- GPIO4_IO07
- *9
- GPIO4_IO06
- GPIO4_IO09
- GPIO7_IO05
- UART5_RXD
- FLEXCAN2_RX
- AUD5_TXC
- AUD5_RXD
- MOSI1 (MCU)
- SCK1 (MCU)
- SPDIF OUT (CPU)
- PWM_0 (MCU)
- PWM_1 (MCU)
- PIO0_21
- PIO1_15
- PIO0_3
- GPIO7_IO09
- GPIO3_IO22
- GPIO6_IO10
- Reset Button Input for CPU
- Reset Out for add-on boards
- CPU_GPIO0
- CPU_GPIO1
- CPU_GPIO2
- (near J1) Def: Input PD
- (near J1) *3
- (near J1) *9
- WDOG1_B
- CSPI1_MISO
- CSPI1_CLK
- PWM1_OUT
- GPIO3_IO17
- GPIO3_IO16
- I2C2_SDA
- GPIO4_IO29
- *7
- GPIO4_IO08
- GPIO2_IO30
- GPIO5_IO09
- I2C2_SCL
- UART5_TXD
- CSPI1_CS0
- CSPI1_CS1
- AUD5_TXFS
- CSPI2_CS1
- MISO1 (MCU)
- WAKEUP (MCU)
- PWM_2 (MCU)
- PWM_3 (MCU)
- PWM_4 (MCU)
- PIO0_15
- PIO0_16
- PIO0_22
- PIO0_23
- ANALOG_IN_0
- ANALOG_IN_1
- ANALOG_IN_2
- ANALOG_IN_3
- MCU only
- (near J1) *1
- WDOG2_B
- CSPI2_CS0
- CSPI2_MOSI
- PWM4_OUT
- GPIO2_IO10
- GPIO4_IO30
- GPIO5_IO12
- GPIO5_IO10
- GPIO3_IO23
- GPIO2_IO09
- GPIO5_IO13
- GPIO5_IO11
- UART3_CTS
- PWM3_OUT
- CSPI2_CLK
- CSPI2_MISO
- UART1_DCD
- function
- peripheral
- DESIGN NOTE:
  All signals on connectors J1 & J2 are pulled high by default (unless noted otherwise). Default states may be different comparing to the Raspberry Pi pull up/down default configuration.
- DESIGN NOTE:
  *4 Pins CANH & CANL can be used as standard GPIOs or FLEXCAN pins. Before using these functions, be sure that the CAN Transceiver is not fitted (U19, U2o, U35, R246, R249, C311 & C312 NF) and signals are bypassed (R41, R117, R411, R412 fitted).
- DESIGN NOTE:
  *7 These signals have series 22R resistor in signal path.
  *8 If I2S Audio (AUD5) is used throught the J2 header, GPIO_OR_CLK can be used as the master clock.
- DESIGN NOTE:
  I2C1 bus bypass options:
  R276 - R279 fitted, R277 & R279 fitted (default) - system I2C connected to the J1 header and MCU
  R276 & R278 fitted; R277 & R279 not fitted - system I2C connected to the J1 header, MCU is disconnected from I2C
  R276 & R278 not fitted; R277 & R279 fitted - system I2C disconnected; MCU I2C or GPIO function on the J1 header. if MCU I2C is used, fit also R290 & R291 pullups.
- DESIGN NOTE:
  Incorrect implementation of resistors R208 - R211 can setup undefined value on CPU_CPIO0 & 1. Be sure, you disable internal pullups for MCU first. Also, be aware, that the CPU_GPIO2 pin has an internal pull down resistor enabled by default.
- DESIGN NOTE:
  All signals on J1 and J2 connector are 3V3 level compatible (unless otherwise noted). Connecting higher voltage may damage the board.
  Exceptions:
  *1 This pin my be connected to input voltage (when R239, R203 or R365 is fitted) to support input voltage monitoring
  *2 Ouput of this signal can be as high as +5V
  *3 Be careful: This pin may be connected to +3V0_SVNVS
- DESIGN NOTE:
  *5 When CANL signal is bypassed and buffer U20 is fitted, this pin can be used as a 5V tolerant input.
  *6 When CANH signal is bypassed and buffer U35 is fitted, this pin can be used as a 5V CPU output.
- DESIGN NOTE:
  *9 These signals can be used as an optional SPDIF digital audio interface:
  - SPDIF_OUT: use CPU_GPIO2
  - SPDIF_IN: use I2C3_SDA. In this case, do not place any other devices on the I2C3 bus.
- DESIGN NOTE:
  If some add-on boards (compatible with short Raspberry Pi connector) require PWM Signal connected to J2-pin12, these signals can be swapped using resistors R366-R369.
- UART 1 - Debug console (+3V3)
- Buffers for CPU Input Pins
- Buffers for CPU Output Pins
- Serial console header
- DESIGN NOTE:
  In the case, when J3 is not used for debugging, but as a standard UART interface,+3V3 power can be provided on J3 pin 3 through D30 or D38.
- DESIGN NOTE:
  If isolation circuits are fitted, the UART signals on J3 support signal levelling defined by device connected to the J3 and voltage connected to J3 pin 3 (e.g. 3V3, 5V, ....)
- DESIGN NOTE:
  FTDI TTL-232R-3V3 Cable Pinout (Left side - Converter; Right Side - OpenRex board)
- Required by default (Input for the board)
- DESIGN NOTE:
  Serial console header is designed to be used with FTDI TTL-232R-3V3 TTL to USB Serial Converter Cable by default:
  http://www.ftdichip.com/Support/Documents/DataSheets/Cables/DS_TTL-232R_CABLES.pdf
- FREE for personal and commercial use. See the license.
- DESIGN NOTE:
  Buffers for UART1 are designed to isolate the CPU when the board is turned off and FTDI cable is still connected. Without the isolation, leaking currect from the plugged FTDI cable can prevent CPU from booting.
- Variant:
- Checked by
- DESIGN NOTE:
  If isolation is not required, buffers can by bypassed through R60, R373, R374 and R378 resistors.
- Designed by www.fedevel.com
- (in symbol 2N7002BKS,115, part A) G1; S1; D1
- (in symbol 2N7002BKS,115, part B) G2; S2; D2
- (in symbol SDTitleBlock) Title:; Page Contents:; Revision:; Size:; DWG NO; Date:; Sheet; of
- (in symbol TPSC107K010R0150) +

### Library data of the parts
C238 = TPSC107K010R0150: CAP TANT 100UF 10V 10% 2312; Manufacturer: AVX Corporation; Manufacturer Size Code: C; Capacitance: 100µF; ESR (Equivalent Series Resistance): 150 mOhm; Type: Molded; .Creator: MM; Supplier 1: Digi-Key; Manufacturer Part Number: TPSC107K010R0150; RoHS: RoHS Compliant; Category: Capacitors; Stock 1: 3211; Pricing 1: 1=1, 10=0.85, 100=0.4969, 250=0.4168 (USD); Packaging: Cut Tape (CT); Tolerance: ±10%; Voltage - Rated: 10V; Operating Temperature: -55°C ~ 125°C; Mounting Type: Surface Mount; Package / Case: 2312 (6032 Metric); Size / Dimension: 0.236" L x 0.126" W (6.00mm x 3.20mm); Height - Seated (Max): 0.110" (2.80mm); Lead Spacing: -; Features: General Purpose; Lifetime @ Temp.: -; ComponentLink1URL: http://www.avx.com/docs/Catalogs/tps.pdf; ComponentLink1Description: http://www.avx.com/docs/Catalogs/tps.pdf; Supplier Part Number 1: 478-7995-1-ND; .Checked PCB: MM; .Checked SCH: MM
C298 C300-C303 C420 C422 = C1005X5R1H104K: as C309 on sheet [23] - SENSORS, CAN, IR; Category: Capacitors; Supplier Part Number: 445-5942-1-ND; Manufacturer Part Number: C1005X5R1H104K; Operating Temperature: -55°C ~ 85°C; Package / Case: 0402 (1005 Metric); Price 1k [$]: 0.02340; .Checked SCH: used; Voltage - Rated: 50V; Supplier: Digikey; Supplier 1: Digi-Key; Supplier Part Number 1: 445-5942-1-ND; RoHS: RoHS Compliant; Stock 1: 106926; Pricing 1: 1=0.27, 10=0.18, 100=0.072, 250=0.05176, 500=0.0369, 1000=0.027 (USD); Tolerance: ±10%; Temperature Coefficient: X5R; Mounting Type: Surface Mount, MLCC; Applications: General Purpose; Ratings: -; Size / Dimension: 0.039" L x 0.020" W (1.00mm x 0.50mm); Height - Seated (Max): -; Thickness (Max): 0.022" (0.55mm); Lead Spacing: -; Features: -; Packaging: Cut Tape (CT); Lead Style: -; ComponentLink1URL: http://www.tdk.co.jp/tefe02/e412_c.pdf; ComponentLink1Description: http://www.tdk.co.jp/tefe02/e412_c.pdf
C299 C419 = C1608X5R0J106M: as C280 on sheet [21] - AUDIO; Category: Capacitors; Supplier Part Number: 445-4112-1-ND; Manufacturer Part Number: C1608X5R0J106M; Operating Temperature: -55°C ~ 85°C; Package / Case: 0603 (1608 Metric); Price 1k [$]: 0.08580; .Checked SCH: used; Voltage - Rated: 6.3V; Features: Low ESR; Supplier: Digikey; Supplier 1: Digi-Key; Supplier Part Number 1: 445-4112-1-ND; RoHS: RoHS Compliant; Stock 1: 48157; Pricing 1: 1=0.46, 10=0.363, 100=0.1898, 250=0.14024, 500=0.1089, 1000=0.0858 (USD); Tolerance: ±20%; Temperature Coefficient: X5R; Mounting Type: Surface Mount, MLCC; Applications: General Purpose; Ratings: -; Size / Dimension: 0.063" L x 0.031" W (1.60mm x 0.80mm); Height - Seated (Max): -; Thickness (Max): 0.037" (0.95mm); Lead Spacing: -; Packaging: Cut Tape (CT); Lead Style: -; ComponentLink1URL: http://www.tdk.com/pdf/general_B11.pdf; ComponentLink1Description: http://www.tdk.com/pdf/general_B11.pdf
C304 C421 = C2012X5R1C106M: CAP CER 10UF 16V 20% X5R 0805; Manufacturer: TDK Corporation; Manufacturer Part Number: C2012X5R1C106M/1.25; Capacitance: 10µF; .Checked PCB: used; Supplier 1: Digi-Key; Supplier Part Number 1: 445-4115-1-ND; RoHS: RoHS Compliant; Category: Capacitors; Stock 1: 66161; Pricing 1: 1=0.45, 10=0.357, 100=0.215, 250=0.16124, 500=0.1376, 1000=0.1075 (USD); Voltage - Rated: 16V; Tolerance: ±20%; Temperature Coefficient: X5R; Mounting Type: Surface Mount, MLCC; Operating Temperature: -55°C ~ 85°C; Applications: General Purpose; Ratings: -; Package / Case: 0805 (2012 Metric); Size / Dimension: 0.079" L x 0.049" W (2.00mm x 1.25mm); Height - Seated (Max): -; Thickness (Max): 0.039" (1.00mm); Lead Spacing: -; Features: -; Packaging: Cut Tape (CT); Lead Style: -; ComponentLink1URL: http://www.tdk.com/pdf/general_B11.pdf; ComponentLink1Description: http://www.tdk.com/pdf/general_B11.pdf; .Checked SCH: used
D4 D8 D31 D32 = PGB1010603MR: SUPPRESSOR ESD 24VDC 0603 SMD; Manufacturer: Littelfuse Inc; Voltage - Reverse Standoff (Typ): 24V; Polarization: Bidirectional; .Creator: MM; .Checked PCB: used; Supplier 1: Digi-Key; Manufacturer Part Number: PGB1010603MR; RoHS: RoHS Compliant; Category: Circuit Protection; Stock 1: 155406; Pricing 1: 1=0.66, 10=0.556, 25=0.4872, 100=0.4172, 250=0.3618, 500=0.30646 (USD); Packaging: Cut Tape (CT); Voltage - Breakdown: -; Power (Watts): -; Mounting Type: Surface Mount; Package / Case: 0603 (1608 Metric); Supplier Device Package: 0603 (1608 Metric); ComponentLink1URL: http://www.littelfuse.com/data/en/Data_Sheets/Littelfuse_PulseGuard-ESD_PGB1.pdf; ComponentLink1Description: http://www.littelfuse.com/data/en/Data_Sheets/Littelfuse_PulseGuard-ESD_PGB1.pdf; Supplier Part Number 1: F2594CT-ND; .Checked SCH: used
D23 = BGX50AE6327: DIODE SWITCHING 50V SOT-143; Manufacturer: Infineon Technologies; .Checked PCB: used; Current - DC Forward (If): 140mA; Diode Type: Single Phase; Speed: Small Signal =< 200mA (Io), Any Speed; Reverse Recovery Time (trr): 6ns; .Checked SCH: used; Category: Discrete Semiconductor Products; Family: Bridge Rectifiers; Manufacturer Part Number: BGX50AE6327; Package / Case: TO-253-4, TO-253AA; Price 1k [$]: 0.10013; Supplier: Digikey; Supplier Part Number: BGX50AINCT-ND; Value: BGX50AE6327; Supplier 1: Digi-Key; Supplier Part Number 1: BGX50AINCT-ND; RoHS: RoHS Compliant; Stock 1: 438; Pricing 1: 1=0.47, 10=0.334, 100=0.2225, 500=0.12906, 1000=0.10013 (USD); Voltage - Peak Reverse (Max): 50V; Mounting Type: Surface Mount; Packaging: Cut Tape (CT); Supplier Device Package: PG-SOT143-4; ComponentLink1URL: http://www.infineon.com/dgdl/bgx50aseries.pdf?folderId=db3a30431400ef6801141cc1c4cd04e8&fileId=db3a30431400ef6801141cc423c404e9; ComponentLink1Description: http://www.infineon.com/dgdl/bgx50aseries.pdf?folderId=db3a30431400ef6801141cc1c4cd04e8&fileId=db3a30431400ef6801141cc423c404e9
D30 D38 = MBR140SFT1G: DIODE SCHOTTKY 40V 1A SOD123L; Manufacturer: ON Semiconductor; Voltage - Forward (Vf) (Max) @ If: 550mV @ 1A; Speed: Fast Recovery =< 500ns, > 200mA (Io); Current - Reverse Leakage @ Vr: 500µA @ 40V; .Creator: MM; Supplier 1: Digi-Key; Manufacturer Part Number: MBR140SFT1G; RoHS: RoHS Compliant; Category: Discrete Semiconductor Products; Stock 1: 9727; Pricing 1: 1=0.47, 10=0.333, 25=0.274, 100=0.2188, 250=0.1594, 500=0.12944, 1000=0.0995 (USD); Packaging: Cut Tape (CT); Diode Type: Schottky; Voltage - DC Reverse (Vr) (Max): 40V; Current - Average Rectified (Io): 1A; Reverse Recovery Time (trr): -; Capacitance @ Vr, F: -; Mounting Type: Surface Mount; Package / Case: SOD-123F; Supplier Device Package: SOD-123L; Operating Temperature - Junction: -55°C ~ 125°C; ComponentLink1URL: http://www.onsemi.com/pub_link/Collateral/MBR140SFT1-D.PDF; ComponentLink1Description: http://www.onsemi.com/pub_link/Collateral/MBR140SFT1-D.PDF; Supplier Part Number 1: MBR140SFT1GOSCT-ND; .Checked PCB: MM; .Checked SCH: MM
FB31 FB32 FB34 FB35 FB39-FB42 = BLM18SG221TN1D: FERRITE CHIP 220 OHM 2500MA 0603; Manufacturer: Murata Electronics North America; Impedance @ Frequency: 220 Ohm @ 100MHz; DC Resistance (DCR): 40 mOhm Max; Filter Type: Differential Mode - Single; Number of Lines: 1; .Checked PCB: used; Supplier 1: Digi-Key; Supplier Part Number 1: 490-5225-1-ND; Manufacturer Part Number: BLM18SG221TN1D; RoHS: RoHS Compliant; Category: Filters; Stock 1: 54640; Pricing 1: 1=0.38, 10=0.282, 50=0.1646, 100=0.1316, 250=0.094, 500=0.06392, 1000=0.0517, 5000=0.04042 (USD); Current Rating: 2.5A; Package / Case: 0603 (1608 Metric); Mounting Type: Surface Mount; Packaging: Cut Tape (CT); Height (Max): 0.037" (0.95mm); Size / Dimension: 0.063" L x 0.031" W (1.60mm x 0.80mm); ComponentLink1URL: http://search.murata.co.jp/Ceramy/image/img/PDF/ENG/L0110S0100BLM18S.pdf; ComponentLink1Description: http://search.murata.co.jp/Ceramy/image/img/PDF/ENG/L0110S0100BLM18S.pdf; .Checked SCH: used
J1 = ESQ-120-14-G-S: CONN RCPT 20POS .100" DUAL GOLD; Manufacturer: Samtec Inc.; Connector Type: Receptacle; Number of Positions: 20; Number of Positions Loaded: All; Pitch: 0.100" (2.54mm); .Creator: MM; .Checked PCB: MM, paper model not checked; Supplier 1: Digi-Key; Manufacturer Part Number: ESQ-120-14-G-S; RoHS: RoHS Compliant; Category: Connectors, Interconnects; Stock 1: 0; Pricing 1: 1=5.67 (USD); Packaging: Tube; Contact Type: Female Socket; Number of Rows: 1; Row Spacing: -; Mounting Type: Through Hole; Termination: Solder; Fastening Type: -; Features: -; Contact Finish: Gold; Contact Finish Thickness: 20µin (0.51µm); Color: Black; ComponentLink1URL: http://suddendocs.samtec.com/prints/esq-1xx-xx-x-x-xxx-xx-x-xx-mkt.pdf; ComponentLink1Description: http://suddendocs.samtec.com/prints/esq-1xx-xx-x-x-xxx-xx-x-xx-mkt.pdf; Supplier Part Number 1: ESQ-120-14-G-S-ND; .Checked SCH: MM
J2 = ESQ-120-14-G-D: CONN RCPT 40POS .100" DUAL GOLD; Manufacturer: Samtec Inc.; Connector Type: Receptacle; Number of Positions: 40; Number of Positions Loaded: All; Pitch: 0.100" (2.54mm); .Creator: MM; Supplier 1: Digi-Key; Manufacturer Part Number: ESQ-120-14-G-D; RoHS: RoHS Compliant; Category: Connectors, Interconnects; Stock 1: 51; Pricing 1: 1=7.42, 10=6.864, 50=6.1586, 100=5.7505, 250=5.00852, 500=4.823, 1000=4.6375, 2500=4.452 (USD); Packaging: Tube; Contact Type: Female Socket; Number of Rows: 2; Row Spacing: 0.100" (2.54mm); Mounting Type: Through Hole; Termination: Solder; Fastening Type: -; Features: -; Contact Finish: Gold; Contact Finish Thickness: 20µin (0.51µm); Color: Black; ComponentLink1URL: http://suddendocs.samtec.com/prints/esq-1xx-xx-x-x-xxx-xx-x-xx-mkt.pdf; ComponentLink1Description: http://suddendocs.samtec.com/prints/esq-1xx-xx-x-x-xxx-xx-x-xx-mkt.pdf; Supplier Part Number 1: SAM8767-ND; .Checked PCB: MM; .Checked SCH: MM
J3 = 68001-206HLF: CONN HEADER 6POS .100 STR 15AU; Manufacturer: FCI; Connector Type: Header, Unshrouded; Number of Positions: 6; Number of Positions Loaded: All; Pitch: 0.100" (2.54mm); .Creator: MM; Supplier 1: Digi-Key; Manufacturer Part Number: 68001-206HLF; RoHS: RoHS Compliant; Category: Connectors, Interconnects; Stock 1: 2198; Pricing 1: 1=0.44, 10=0.412, 25=0.3704, 50=0.3292, 100=0.3156, 250=0.28812, 500=0.2744, 1000=0.22638, 2500=0.2058 (USD); Packaging: Bulk; Contact Type: Male Pin; Number of Rows: 1; Row Spacing: -; Contact Mating Length: 0.230" (5.84mm); Mounting Type: Through Hole; Termination: Solder; Fastening Type: -; Features: -; Contact Finish: Gold; Contact Finish Thickness: 15µin (0.38µm); Color: Black; ComponentLink1URL: http://portal.fciconnect.com/Comergent//fci/drawing/68000.pdf; ComponentLink1Description: http://portal.fciconnect.com/Comergent//fci/drawing/68000.pdf; Supplier Part Number 1: 609-3403-ND; .Checked PCB: MM; .Checked SCH: MM
L7 = ACM2012-900-2P-T002: CHOKE COMM MODE 90 OHM .4A SMD; Manufacturer: TDK Corporation; Filter Type: Data, Signal Line; Number of Lines: 2; Current: 400mA; DC Resistance (DCR): 190 mOhm Max; Impedance: 90 Ohm; Resistance (Ohms): 8.2K; Power (Watts): 0.063W, 1/16W; Temperature Coefficient: ±100ppm/°C; Tolerance: ±1%; .Checked PCB: used; Supplier 1: Digi-Key; Supplier Part Number 1: 445-2207-1-ND; Manufacturer Part Number: ACM2012-900-2P-T002; RoHS: RoHS Compliant; Category: Filters; Stock 1: 175768; Pricing 1: 1=0.48, 10=0.448, 50=0.42, 100=0.364, 500=0.308, 1000=0.252 (USD); Inductance: -; Mounting Type: Surface Mount; Size / Dimension: 0.079" L x 0.047" W (2.00mm x 1.20mm); Height (Max): 0.051" (1.30mm); Package / Case: 0805 (2012 Metric), 4 Lead; Operating Temperature: -25°C ~ 85°C; Packaging: Cut Tape (CT); ComponentLink1URL: http://www.tdk.co.jp/tefe02/e9719_acm2012.pdf; ComponentLink1Description: http://www.tdk.co.jp/tefe02/e9719_acm2012.pdf; Composition: Thick Film; Features: -; Height: 0.016" (0.40mm); Number of Terminations: 2; ComponentLink2URL: http://www.yageo.com/documents/recent/PYu-RC0402_51_RoHS_L_6.pdf; ComponentLink2Description: http://www.yageo.com/documents/recent/PYu-RC0402_51_RoHS_L_6.pdf; .Checked SCH: used
Q8 Q11 = 2N7002BKS,115: MOSFET 2N-CH 60V 0.3A 6TSSOP; Manufacturer: NXP Semiconductors; FET Type: 2 N-Channel (Dual); FET Feature: Logic Level Gate; Current - Continuous Drain (Id) @ 25°C: 300mA; Rds On (Max) @ Id, Vgs: 1.6 Ohm @ 500mA, 10V; Vgs(th) (Max) @ Id: 2.1V @ 250µA; Gate Charge (Qg) @ Vgs: 0.6nC @ 4.5V; Input Capacitance (Ciss) @ Vds: 50pF @ 10V; Power - Max: 295mW; .Creator: MM; Supplier 1: Digi-Key; Manufacturer Part Number: 2N7002BKS,115; RoHS: RoHS Compliant; Category: Discrete Semiconductor Products; Stock 1: 34098; Pricing 1: 1=0.54, 10=0.389, 25=0.3028, 100=0.2293, 250=0.16212, 500=0.12978, 1000=0.09954 (USD); Packaging: Cut Tape (CT); Drain to Source Voltage (Vdss): 60V; Mounting Type: Surface Mount; Package / Case: 6-TSSOP, SC-88, SOT-363; Supplier Device Package: 6-TSSOP; ComponentLink1URL: http://www.nxp.com/documents/data_sheet/2N7002BKS.pdf; ComponentLink1Description: http://www.nxp.com/documents/data_sheet/2N7002BKS.pdf; Supplier Part Number 1: 568-5977-1-ND; .Checked SCH: MM; .Checked PCB: MM; Referenced footrpint used by MM: http://www.diodes.com/_files/datasheets/ap02001.pdf
R60 R276-R279 R366-R369 R373 R374 R378 = RC0402JR-070RL: as R41 on sheet [23] - SENSORS, CAN, IR; Category: Resistors; Supplier Part Number: 311-0.0JRCT-ND; Manufacturer Part Number: RC0402JR-070RL; Package / Case: 0402 (1005 Metric); Price 1k [$]: 0.01389; Value: 0R; .Checked SCH: used; Supplier: Digikey; Supplier 1: Digi-Key; Supplier Part Number 1: 311-0.0JRCT-ND; RoHS: RoHS Compliant; Stock 1: 1106330; Pricing 1: 10=0.012, 50=0.009, 100=0.0069, 250=0.00512, 500=0.0038, 1000=0.00253 (USD); Composition: Thick Film; Features: -; Temperature Coefficient: -; Size / Dimension: 0.039" L x 0.020" W (1.00mm x 0.50mm); Height: 0.016" (0.40mm); Number of Terminations: 2; Packaging: Cut Tape (CT); ComponentLink1URL: http://www.yageo.com/documents/recent/PYu-RC0402_51_RoHS_L_6.pdf; ComponentLink1Description: http://www.yageo.com/documents/recent/PYu-RC0402_51_RoHS_L_6.pdf
R203 R239 R365 = RMCF0402FT100K: RES 100K OHM 1/16W 1% 0402 SMD; Manufacturer: Stackpole Electronics Inc; Power (Watts): 0.063W, 1/16W; .Checked PCB: used; Temperature Coefficient: ±100ppm/°C; Category: Resistors; Supplier Part Number: RMCF0402FT100KCT-ND; Manufacturer Part Number: RMCF0402FT100K; Package / Case: 0402 (1005 Metric); Price 1k [$]: 0.00384; Resistance (Ohms): 100K; Tolerance: ±1%; Value: 100k; .Checked SCH: used; Supplier: Digikey; Supplier 1: Digi-Key; Supplier Part Number 1: RMCF0402FT100KCT-ND; RoHS: RoHS Compliant; Stock 1: 95; Pricing 1: 1=0.04, 10=0.025, 50=0.0138, 100=0.0105, 250=0.0078, 500=0.00576, 1000=0.00384 (USD); Composition: Thick Film; Features: -; Size / Dimension: 0.039" L x 0.020" W (1.00mm x 0.50mm); Height: 0.016" (0.40mm); Number of Terminations: 2; Packaging: Cut Tape (CT); ComponentLink1URL: http://www.seielect.com/Catalog/SEI-RMCF.pdf; ComponentLink1Description: http://www.seielect.com/Catalog/SEI-RMCF.pdf
R208-R211 = RC0402FR-0710KL: as R110 on sheet [23] - SENSORS, CAN, IR; Category: Resistors; Supplier Part Number: 311-10.0KLRCT-ND; Manufacturer Part Number: RC0402FR-0710KL; Package / Case: 0402 (1005 Metric); Price 1k [$]: 0.01421; Resistance (Ohms): 10K; Tolerance: ±1%; Value: 10k; .Checked SCH: used; Supplier: Digikey; Supplier 1: Digi-Key; Supplier Part Number 1: 311-10.0KLRCT-ND; RoHS: RoHS Compliant; Stock 1: 2916495; Pricing 1: 10=0.014, 50=0.0104, 100=0.0079, 250=0.00584, 500=0.00432, 1000=0.00288 (USD); Composition: Thick Film; Features: -; Size / Dimension: 0.039" L x 0.020" W (1.00mm x 0.50mm); Height: 0.016" (0.40mm); Number of Terminations: 2; Packaging: Cut Tape (CT); ComponentLink1URL: http://www.yageo.com/documents/recent/PYu-RC0402_51_RoHS_L_6.pdf; ComponentLink1Description: http://www.yageo.com/documents/recent/PYu-RC0402_51_RoHS_L_6.pdf
R370-R372 R375-R377 = RC0402FR-073K3L: RES 3.30K OHM 1/16W 1% 0402 SMD; Manufacturer: Yageo; Resistance (Ohms): 3.3K; Power (Watts): 0.063W, 1/16W; .Checked PCB: used; Temperature Coefficient: ±100ppm/°C; Category: Resistors; Supplier Part Number: 311-3.30KLRCT-ND; Manufacturer Part Number: RC0402FR-073K3L; Package / Case: 0402 (1005 Metric); Price 1k [$]: 0.01421; Tolerance: ±1%; Value: 3k3; .Checked SCH: used; Supplier: Digikey; Supplier 1: Digi-Key; Supplier Part Number 1: 311-3.30KLRCT-ND; RoHS: RoHS Compliant; Stock 1: 356340; Pricing 1: 10=0.014, 50=0.0104, 100=0.0079, 250=0.00584, 500=0.00432, 1000=0.00288 (USD); Composition: Thick Film; Features: -; Size / Dimension: 0.039" L x 0.020" W (1.00mm x 0.50mm); Height: 0.016" (0.40mm); Number of Terminations: 2; Packaging: Cut Tape (CT); ComponentLink1URL: http://www.yageo.com/documents/recent/PYu-RC0402_51_RoHS_L_6.pdf; ComponentLink1Description: http://www.yageo.com/documents/recent/PYu-RC0402_51_RoHS_L_6.pdf

## Sheet [29] - POWER SEQUENCING.SchDoc
size A2; DocumentNumber: 29; SheetNumber: 29; SheetTotal: 31
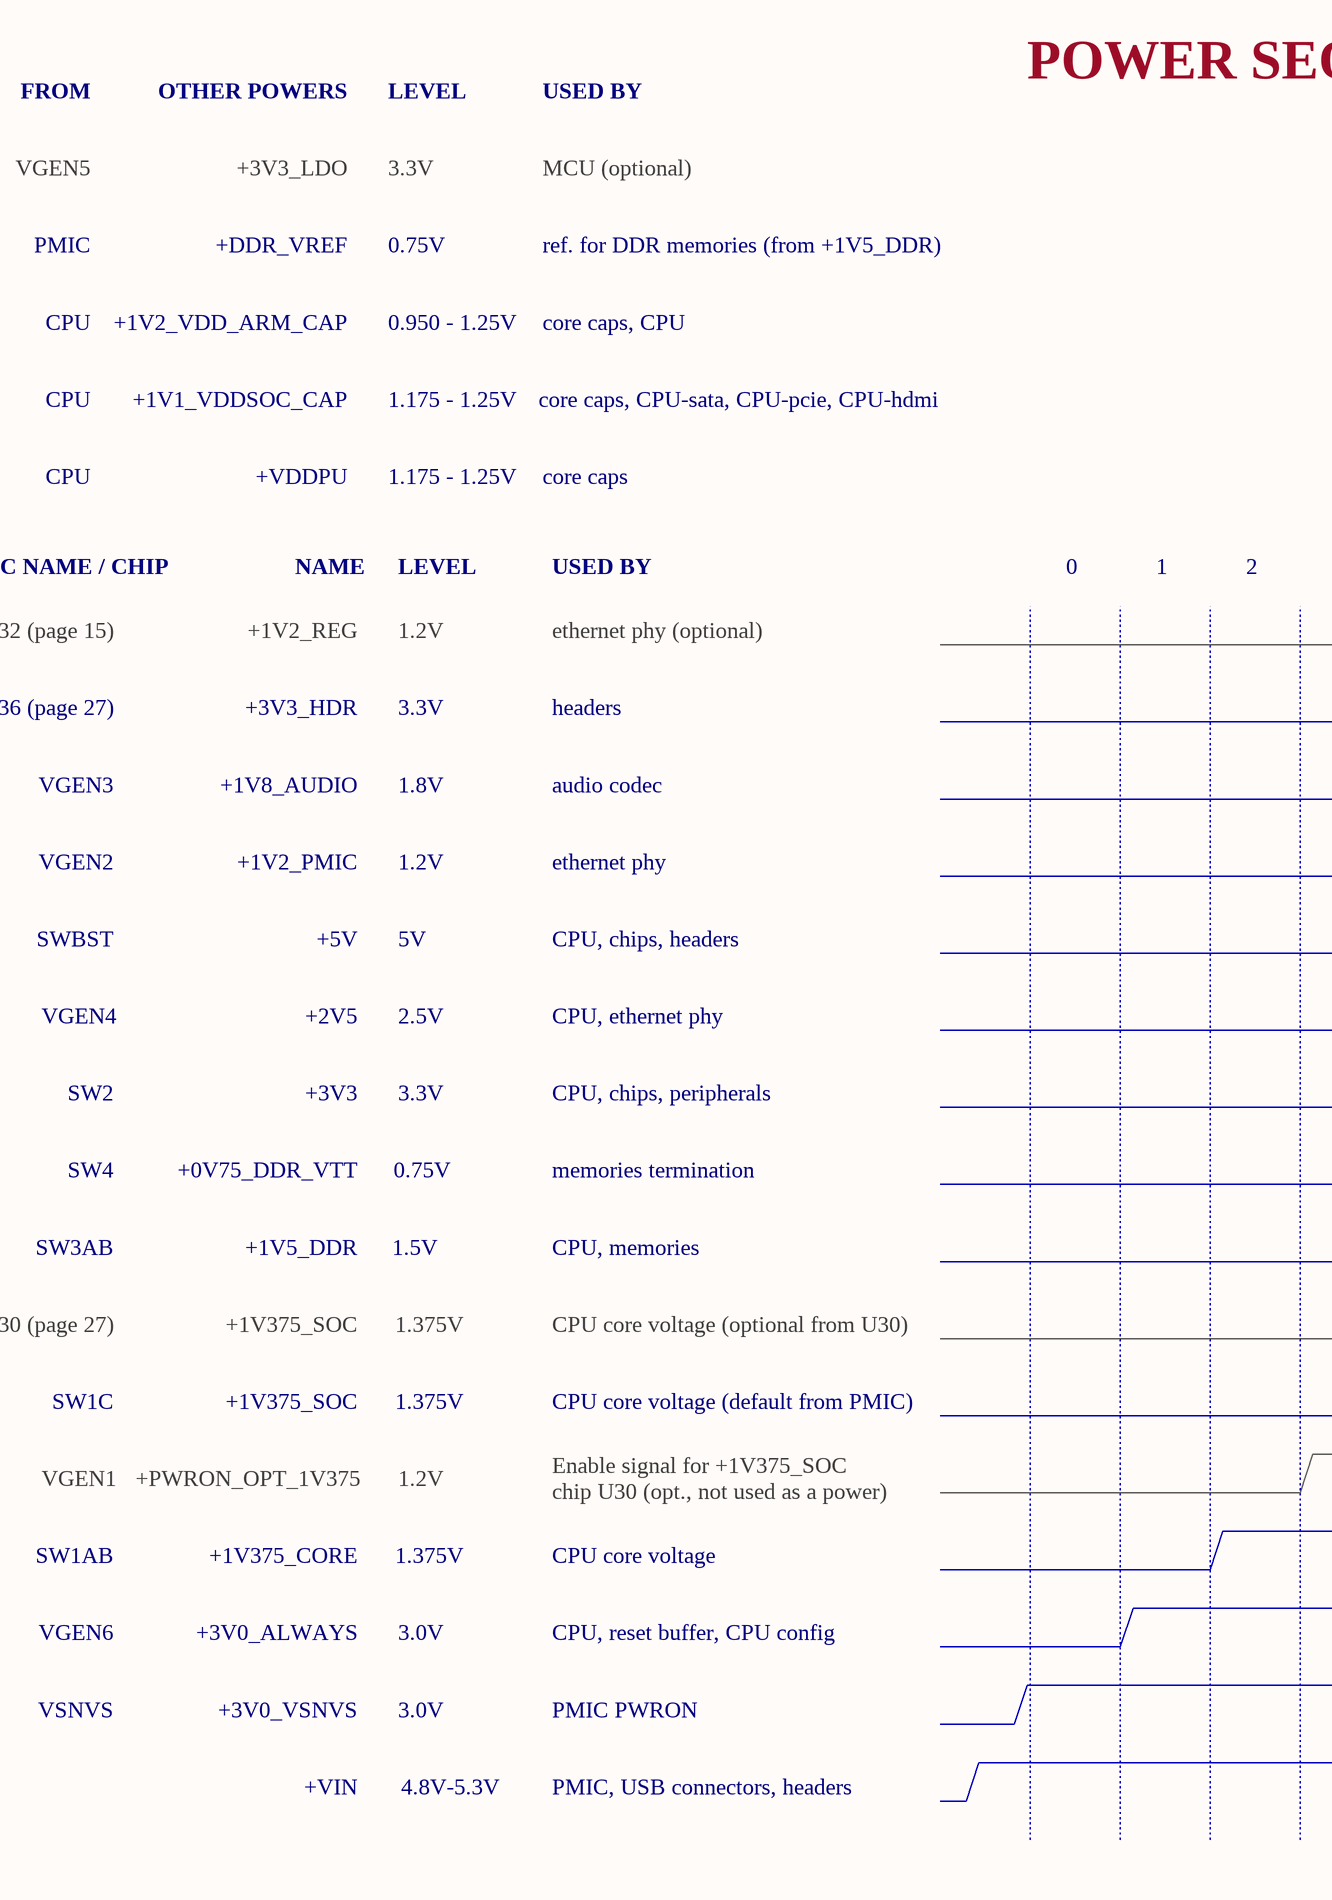
[diagram p49: [29] - POWER SEQUENCING.SchDoc, left]
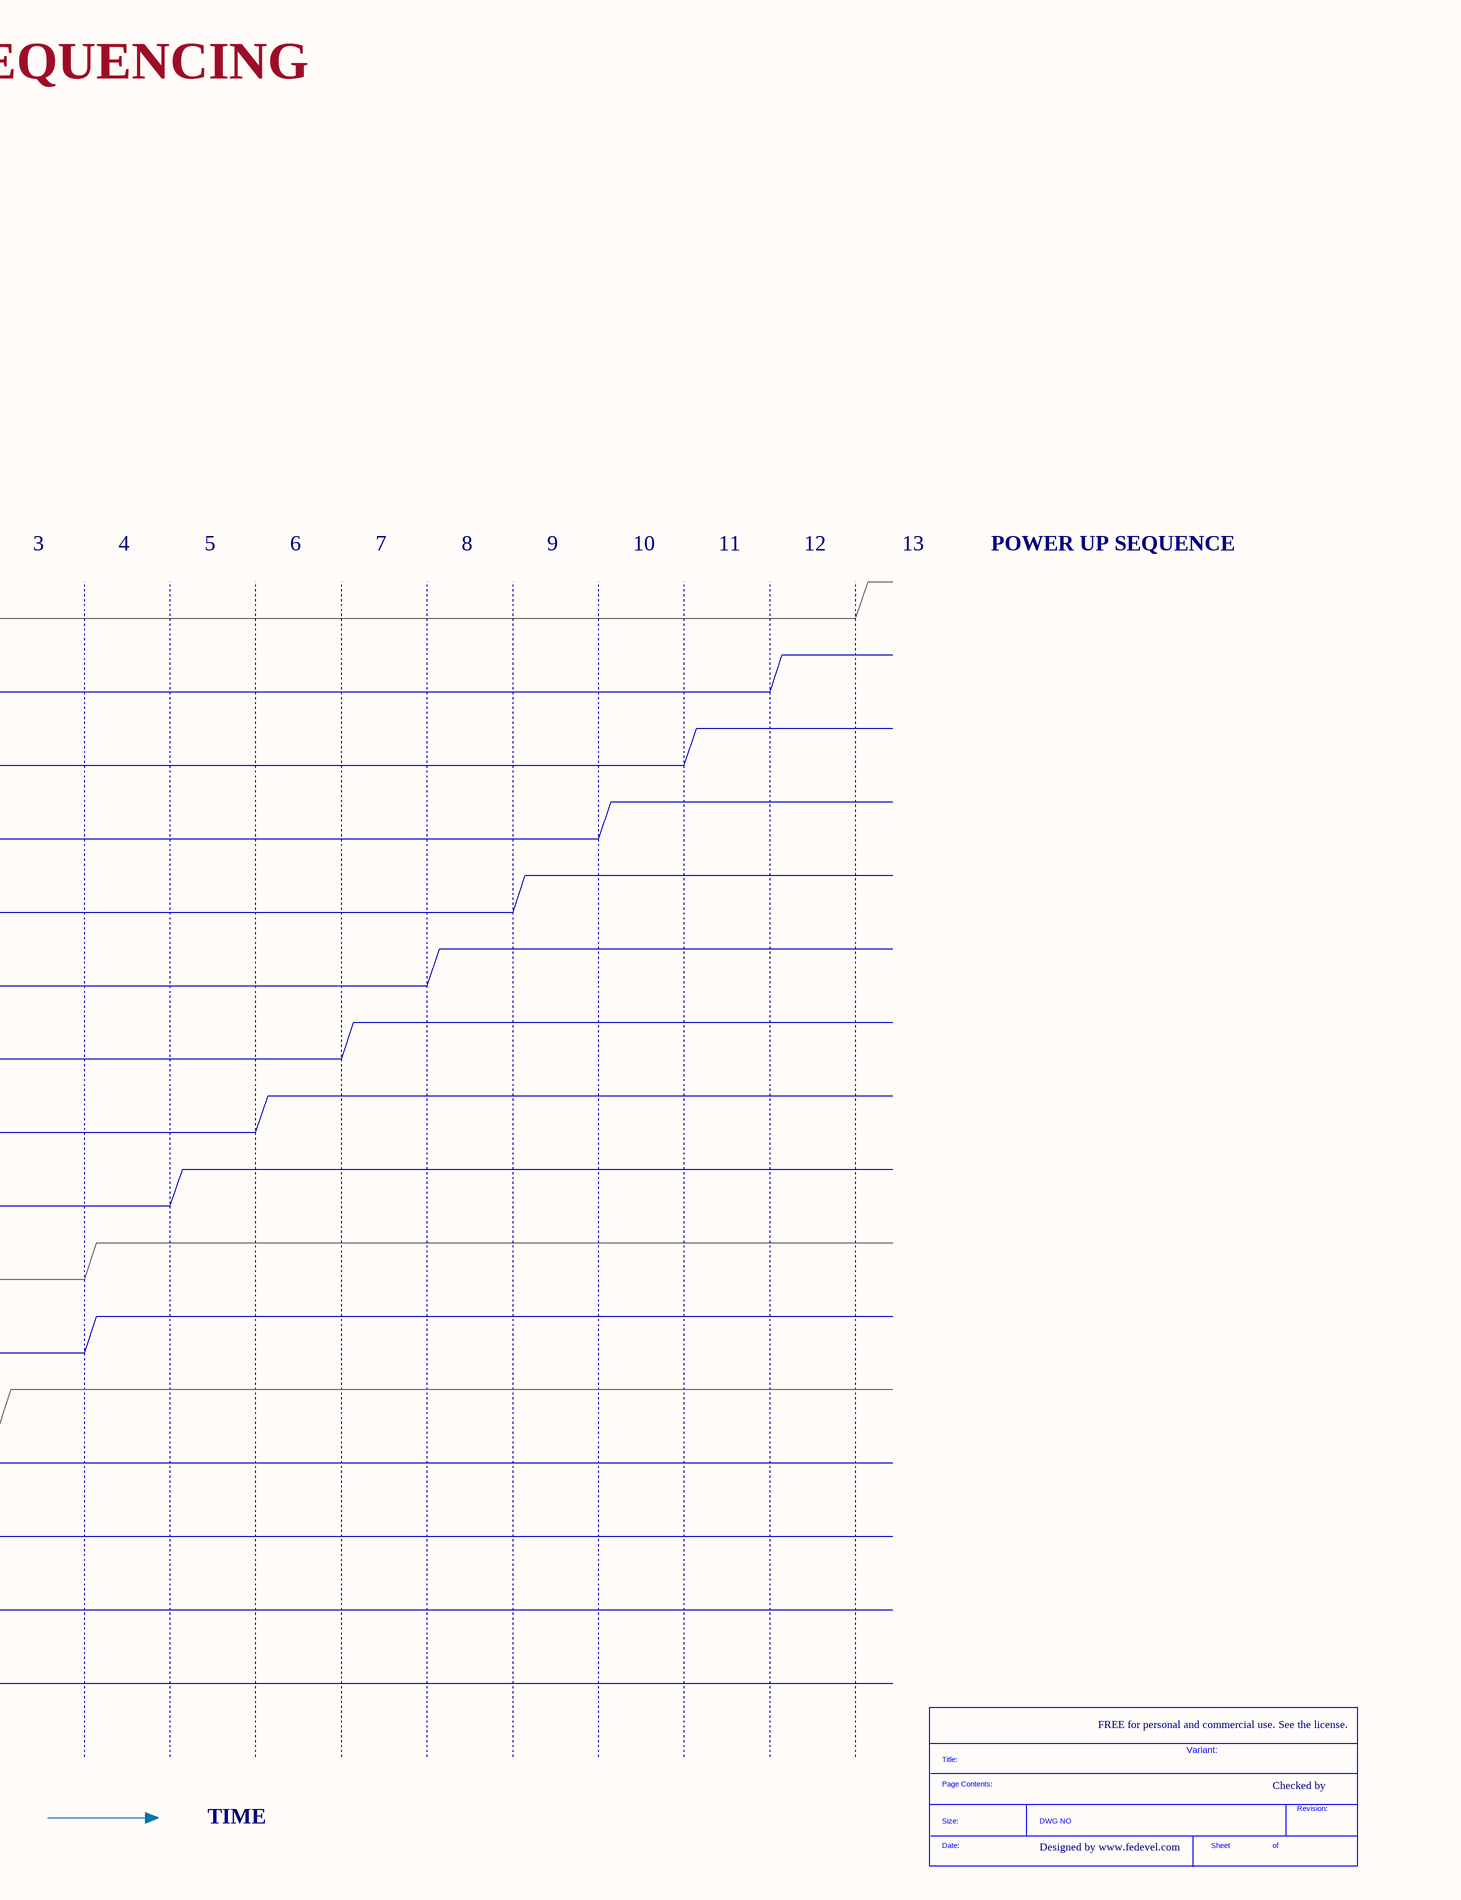
[diagram p50: [29] - POWER SEQUENCING.SchDoc, right]

### Parts
(Parts that share a designator on the sheet are numbered #1, #2 ... from top to bottom, then left to right.)
*#30  SDTitleBlock  (value not drawn)  (graphical)

### Notes on the sheet
- POWER SEQUENCING
- FROM
- OTHER POWERS
- LEVEL
- USED BY
- VGEN5
- +3V3_LDO
- 3.3V
- MCU (optional)
- PMIC
- +DDR_VREF
- 0.75V
- ref. for DDR memories (from +1V5_DDR)
- CPU
- +1V2_VDD_ARM_CAP
- 0.950 - 1.25V
- core caps, CPU
- +1V1_VDDSOC_CAP
- 1.175 - 1.25V
- core caps, CPU-sata, CPU-pcie, CPU-hdmi
- +VDDPU
- core caps
- PMIC NAME / CHIP
- NAME
- 0
- 1
- 2
- 3
- 4
- 5
- 6
- 7
- 8
- 9
- 10
- 11
- 12
- 13
- POWER UP SEQUENCE
- U32 (page 15)
- +1V2_REG
- 1.2V
- ethernet phy (optional)
- U36 (page 27)
- +3V3_HDR
- headers
- VGEN3
- +1V8_AUDIO
- 1.8V
- audio codec
- VGEN2
- +1V2_PMIC
- ethernet phy
- SWBST
- +5V
- 5V
- CPU, chips, headers
- VGEN4
- +2V5
- 2.5V
- CPU, ethernet phy
- SW2
- +3V3
- CPU, chips, peripherals
- SW4
- +0V75_DDR_VTT
- memories termination
- SW3AB
- +1V5_DDR
- 1.5V
- CPU, memories
- U30 (page 27)
- +1V375_SOC
- 1.375V
- CPU core voltage (optional from U30)
- SW1C
- CPU core voltage (default from PMIC)
- VGEN1
- +PWRON_OPT_1V375
- Enable signal for +1V375_SOC
- chip U30 (opt., not used as a power)
- SW1AB
- +1V375_CORE
- CPU core voltage
- VGEN6
- +3V0_ALWAYS
- 3.0V
- CPU, reset buffer, CPU config
- VSNVS
- +3V0_VSNVS
- PMIC PWRON
- +VIN
- 4.8V-5.3V
- PMIC, USB connectors, headers
- FREE for personal and commercial use. See the license.
- Variant:
- Checked by
- TIME
- Designed by www.fedevel.com
- (in symbol SDTitleBlock) Title:; Page Contents:; Revision:; Size:; DWG NO; Date:; Sheet; of